# EAGLE board host (EAGLE 9.6.2)
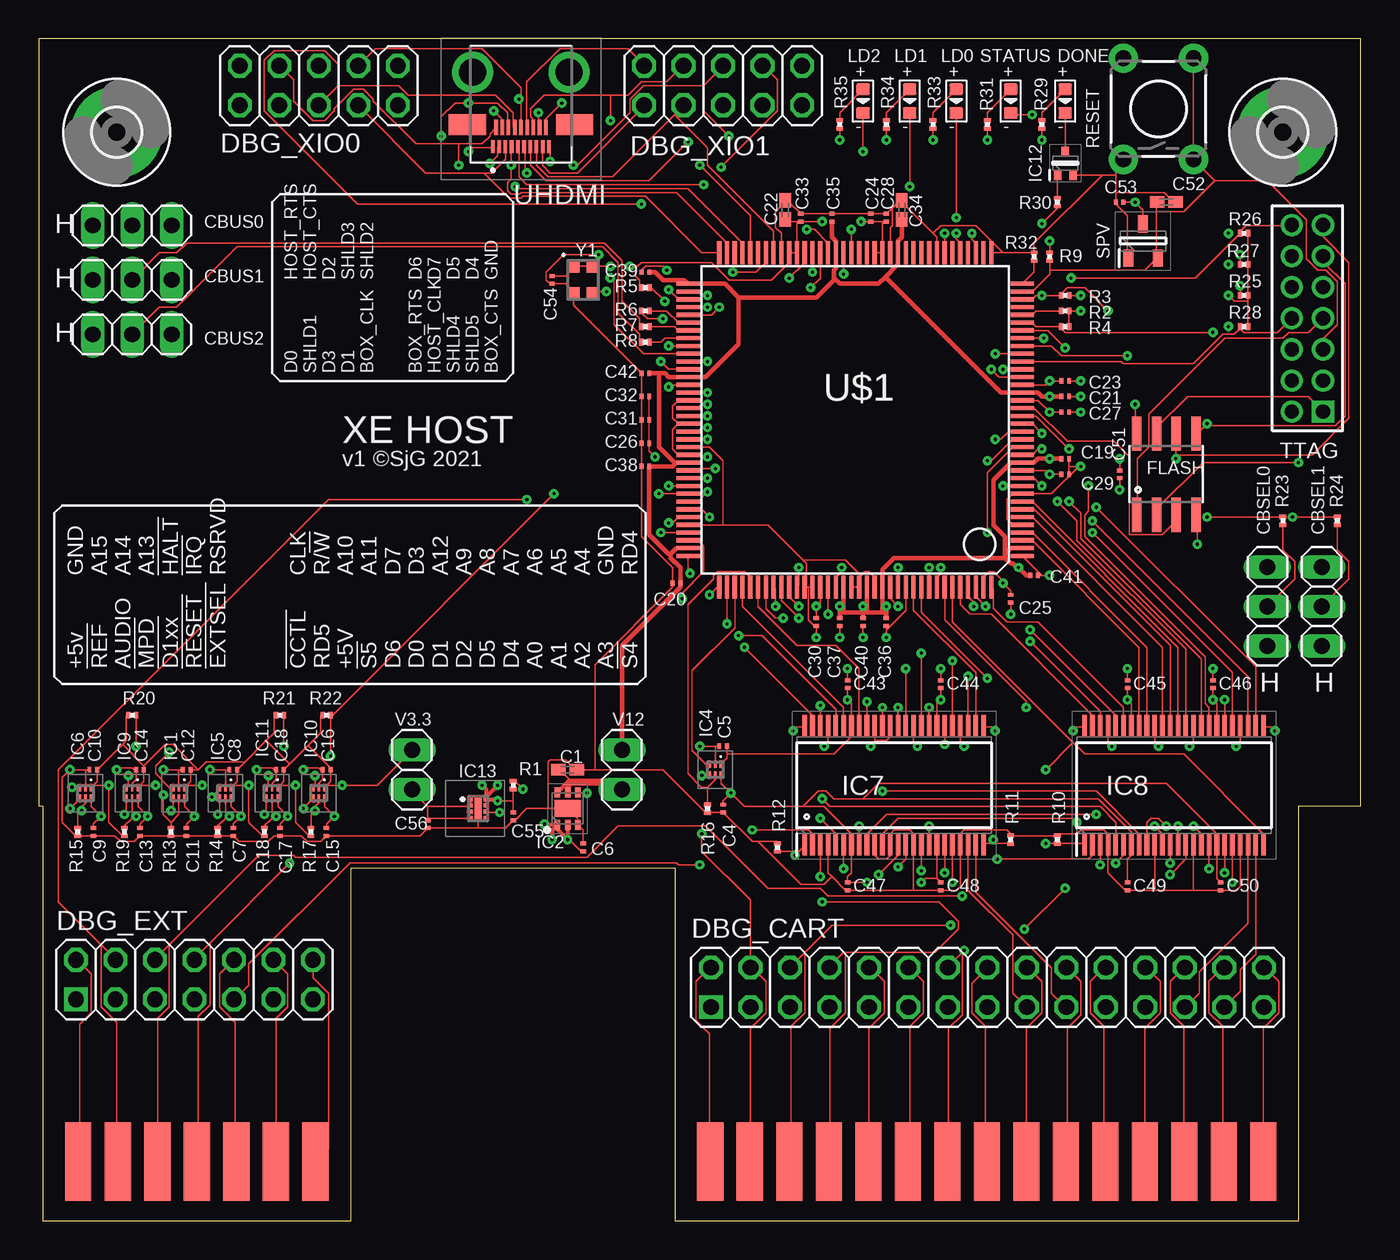
[diagram p5: board, top side]
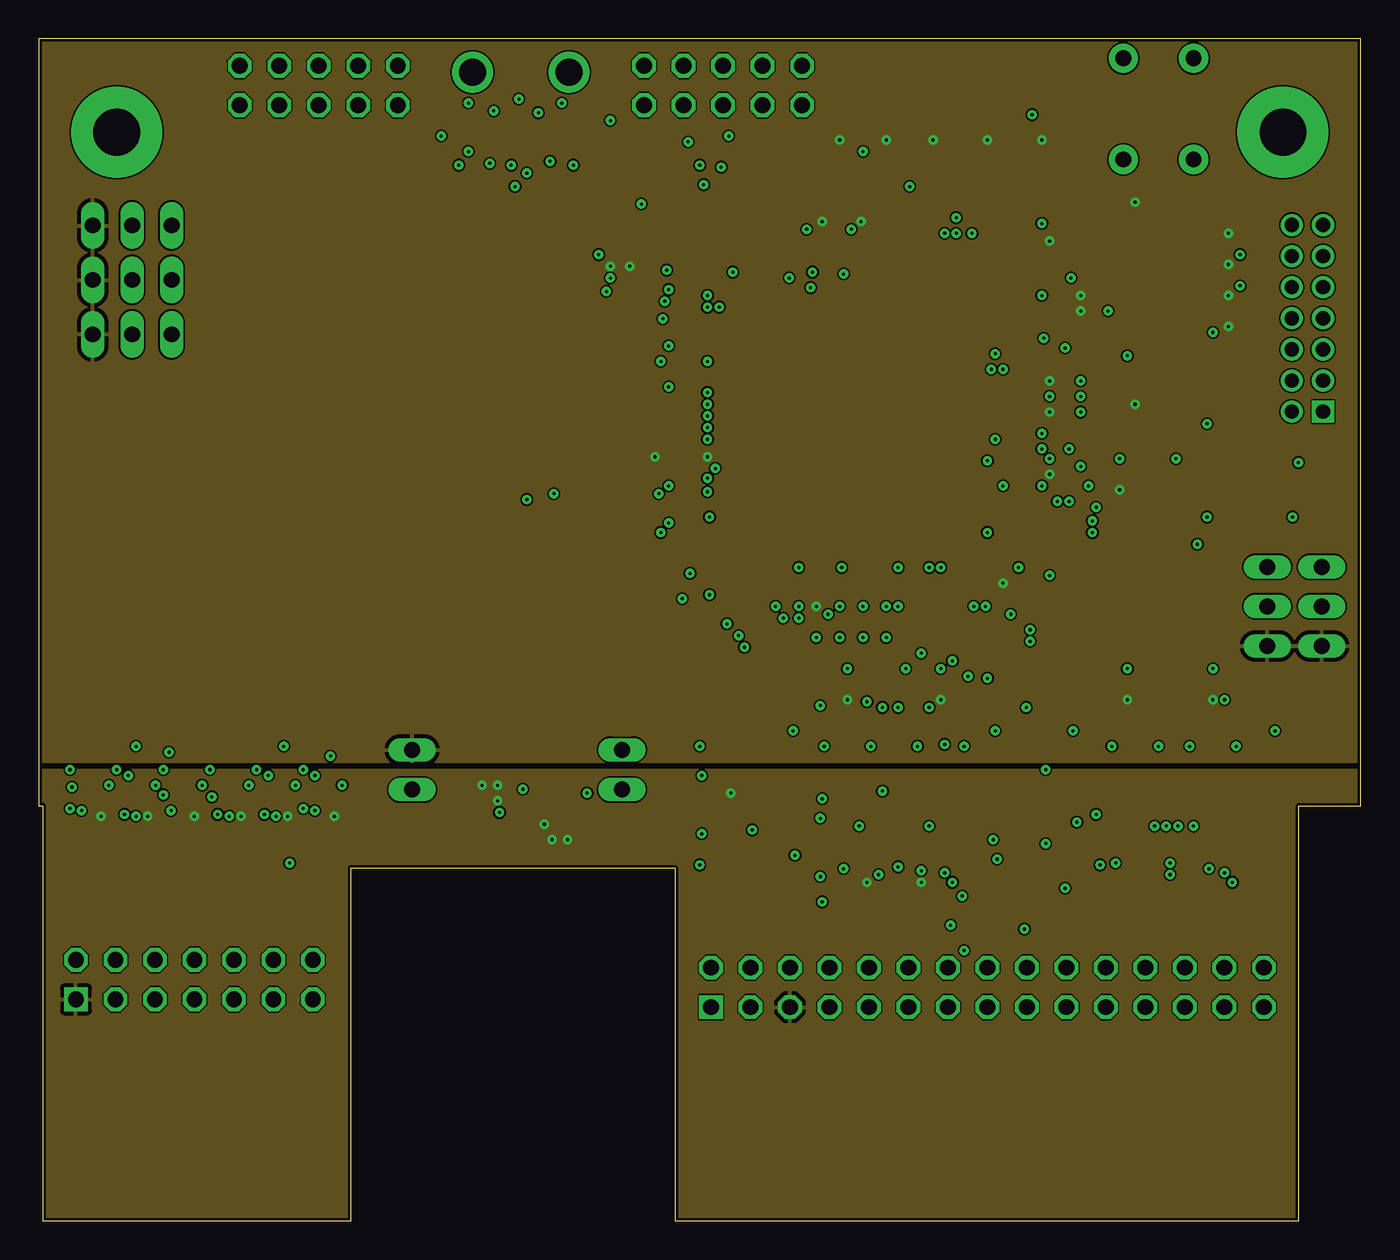
[diagram p6: board, inner layer Route2]
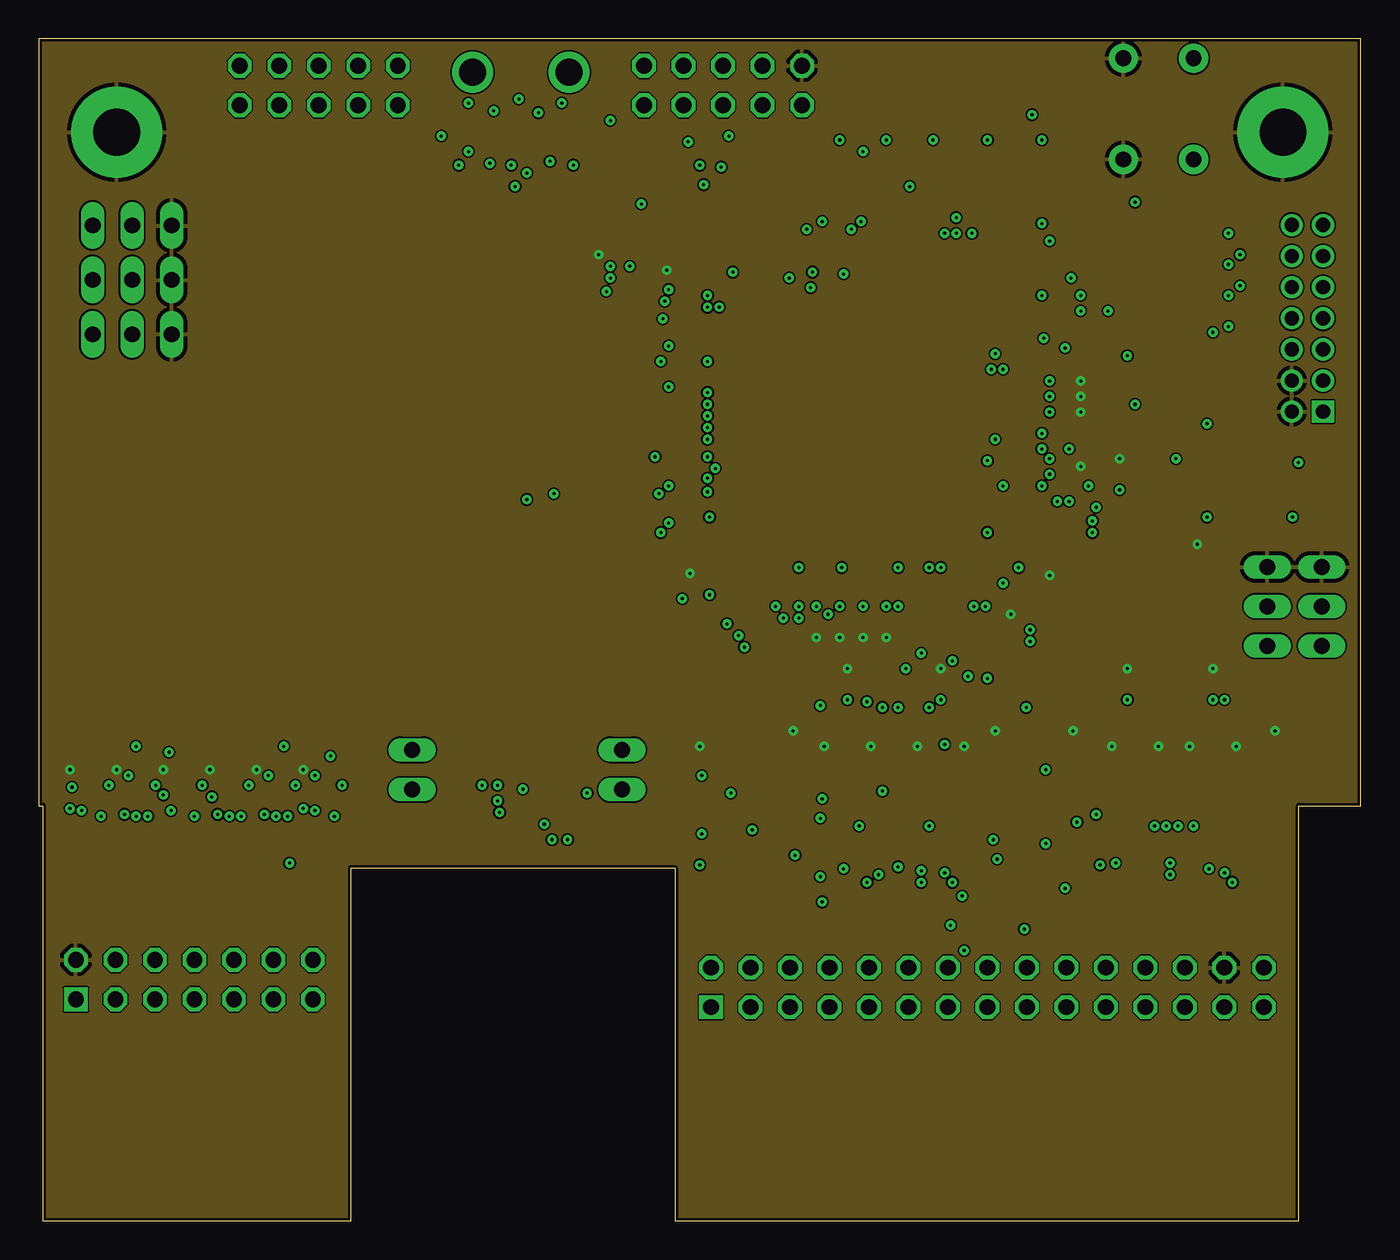
[diagram p7: board, inner layer Route15]
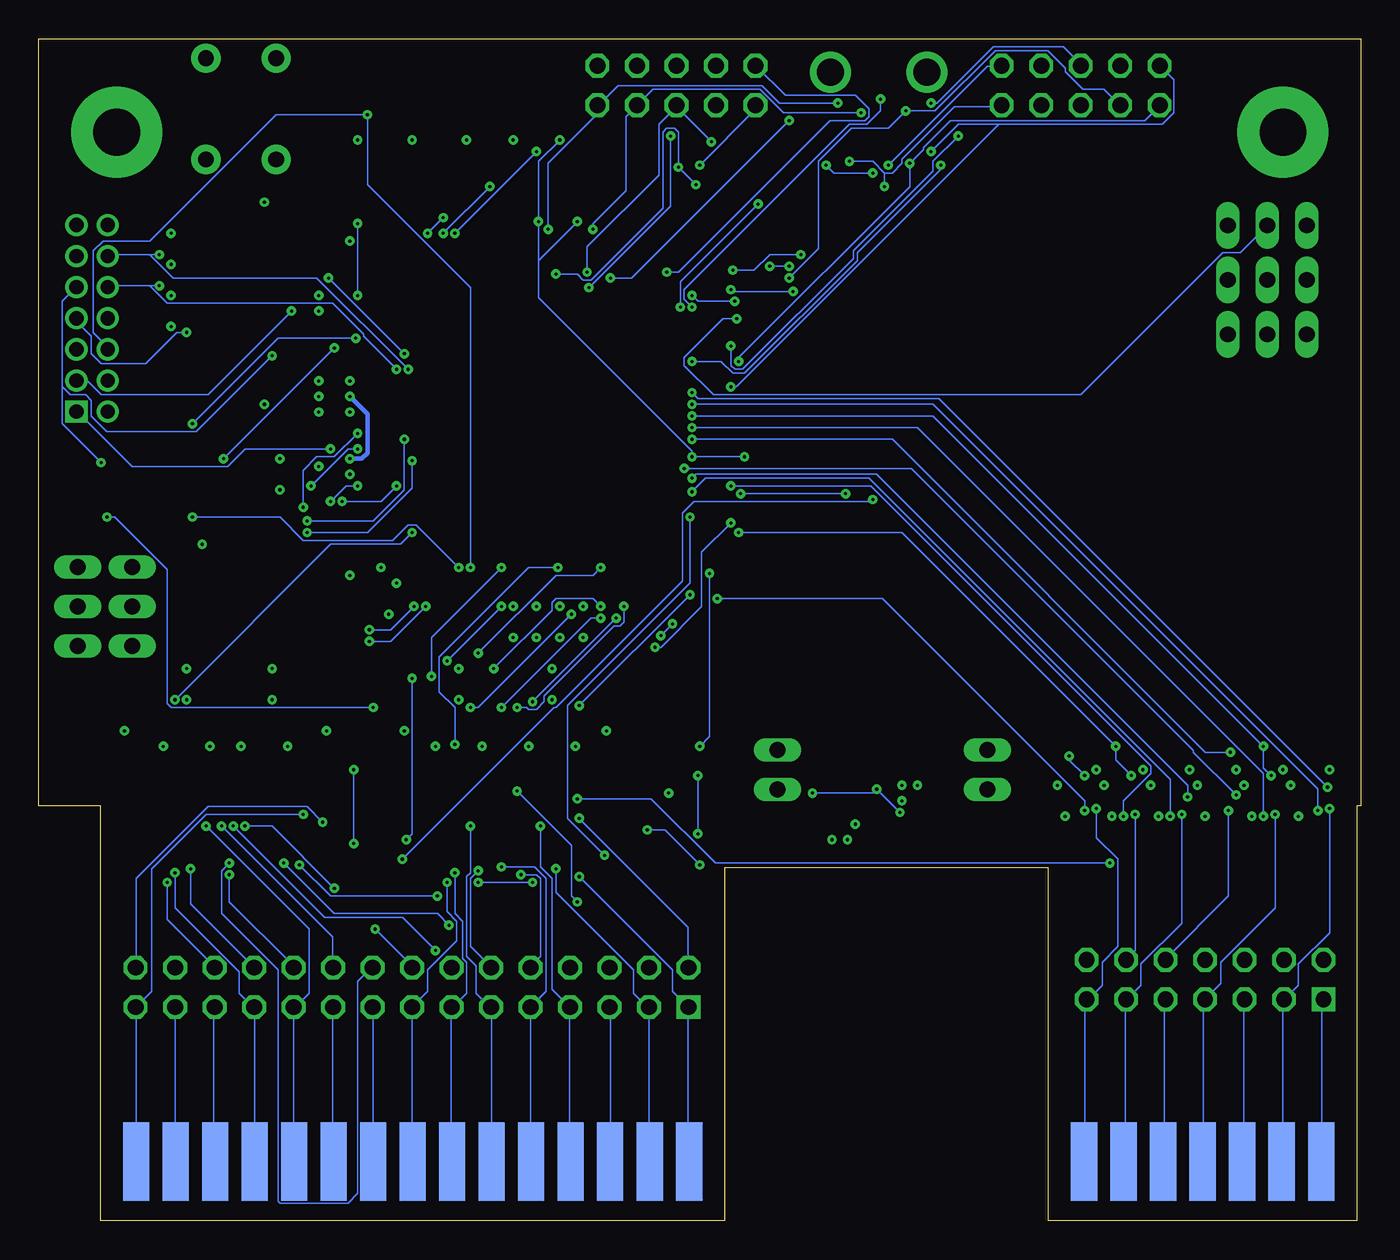
[diagram p8: board, bottom side, seen from below]

Size 85 x 76 mm. Coordinates in mm from the lower left corner, seen from the top.
Outline: 81.28,26.67 85,26.67 85,76 0,76 0,26.67
Copper layers (1+2*15+16): Top 0.035mm / dielectric 1.5mm / Route2 0.035mm / dielectric 0.15mm / Route15 0.035mm / dielectric 0.2mm / Bottom 0.035mm
Design rules "default *": minimum track width 4mil, minimum drill 0.2mm, track to track 4mil, track to pad 4mil, pad to pad 4mil, via to via 4mil, smd to smd 4mil, copper to edge 0.2mm, drill to drill 4mil, minimum pad ring 10mil, minimum via ring 8mil, stop-mask expansion 4mil, vias tented up to drill 0mil, thermal gap 10mil
Net classes: 1 +5v: width 0.305 mm; 2 +1.2v: width 0.305 mm
vRestrict: area -1,0 to 82,11; area 1,34.5 to 39,46; area 15,54 to 30.5,66

## Footprints (pad centres in the part's own frame; a part is rotated, then mirrored left to right if it is on the bottom)
C0402K = smd 0.925 x 0.74: 1 -0.6,0; 2 0.6,0
C0201 = smd 0.25 x 0.35: 1 -0.25,0; 2 0.25,0
1X03 = drill 1.016 long: 1 -2.54,0; 2 0,0; 3 2.54,0
2X15 = drill 1.016 square: 1 -17.78,-1.27 | drill 1.016 octagon: 2 -17.78,1.27; 3 -15.24,-1.27; 4 -15.24,1.27; 5 -12.7,-1.27; 6 -12.7,1.27; 7 -10.16,-1.27; 8 -10.16,1.27; 9 -7.62,-1.27; 10 -7.62,1.27; 11 -5.08,-1.27; 12 -5.08,1.27; 13 -2.54,-1.27; 14 -2.54,1.27; 15 0,-1.27; 16 0,1.27; 17 2.54,-1.27; 18 2.54,1.27; 19 5.08,-1.27; 20 5.08,1.27; 21 7.62,-1.27; 22 7.62,1.27; 23 10.16,-1.27; 24 10.16,1.27; 25 12.7,-1.27; 26 12.7,1.27; 27 15.24,-1.27; 28 15.24,1.27; 29 17.78,-1.27; 30 17.78,1.27
2X07 = drill 1.016 square: 1 -7.62,-1.27 | drill 1.016 octagon: 2 -7.62,1.27; 3 -5.08,-1.27; 4 -5.08,1.27; 5 -2.54,-1.27; 6 -2.54,1.27; 7 0,-1.27; 8 0,1.27; 9 2.54,-1.27; 10 2.54,1.27; 11 5.08,-1.27; 12 5.08,1.27; 13 7.62,-1.27; 14 7.62,1.27
2X05 = drill 1.016 octagon: 1 -5.08,-1.27; 2 -5.08,1.27; 3 -2.54,-1.27; 4 -2.54,1.27; 5 0,-1.27; 6 0,1.27; 7 2.54,-1.27; 8 2.54,1.27; 9 5.08,-1.27; 10 5.08,1.27
LED-0603 = smd 0.762 x 0.889: + -0.762,0; - 0.762,0
SO08 = smd 0.61 x 2.21: 1 -1.905,-2.616; 2 -0.635,-2.616; 3 0.635,-2.616; 4 1.905,-2.616; 5 1.905,2.616; 6 0.635,2.616; 7 -0.635,2.616; 8 -1.905,2.616
3,0-PAD = drill 3 pad 5.842: B3,0 0,0
74LVC1G3157GS132 = smd 0.15 x 0.5: 1 -0.35,-0.35; 2 0,-0.35; 3 0.35,-0.35; 4 0.35,0.35; 5 0,0.35; 6 -0.35,0.35
SON65P200X200X80-7N = smd 0.65 x 0.35: 1 -1.05,0.65; 2 -1.05,0; 3 -1.05,-0.65; 4 1.05,-0.65; 5 1.05,0; 6 1.05,0.65 | smd 1.1 x 1.7: 7 0,0
SOP50P810X120-48N = smd 1.425 x 0.3: 1 -3.812,5.75; 2 -3.812,5.25; 3 -3.812,4.75; 4 -3.812,4.25; 5 -3.812,3.75; 6 -3.812,3.25; 7 -3.812,2.75; 8 -3.812,2.25; 9 -3.812,1.75; 10 -3.812,1.25; 11 -3.812,0.75; 12 -3.812,0.25; 13 -3.812,-0.25; 14 -3.812,-0.75; 15 -3.812,-1.25; 16 -3.812,-1.75; 17 -3.812,-2.25; 18 -3.812,-2.75; 19 -3.812,-3.25; 20 -3.812,-3.75; 21 -3.812,-4.25; 22 -3.812,-4.75; 23 -3.812,-5.25; 24 -3.812,-5.75; 25 3.812,-5.75; 26 3.812,-5.25; 27 3.812,-4.75; 28 3.812,-4.25; 29 3.812,-3.75; 30 3.812,-3.25; 31 3.812,-2.75; 32 3.812,-2.25; 33 3.812,-1.75; 34 3.812,-1.25; 35 3.812,-0.75; 36 3.812,-0.25; 37 3.812,0.25; 38 3.812,0.75; 39 3.812,1.25; 40 3.812,1.75; 41 3.812,2.25; 42 3.812,2.75; 43 3.812,3.25; 44 3.812,3.75; 45 3.812,4.25; 46 3.812,4.75; 47 3.812,5.25; 48 3.812,5.75
SOTFL50P160X78-3N = smd 0.635 x 0.48: 1 -0.758,0.5; 2 -0.758,-0.5; 3 0.758,0
NCP186AMX330TAG = smd 0.26 x 0.35: 1 -0.6,-0.275; 2 -0.2,-0.275; 3 0.2,-0.275; 4 0.6,-0.275; 5 0.6,0.775; 6 0.2,0.775; 7 -0.2,0.775; 8 -0.6,0.775 | smd 1.44 x 0.44: 9 0,0.25
R0201 = smd 0.28 x 0.43: 1 -0.255,0; 2 0.255,0
TACTILE-PTH = drill 1.016 pad 1.88: 1 -3.251,2.261; 2 3.251,2.261; 3 -3.251,-2.261; 4 3.251,-2.261
SOT95P237X111-3N = smd 1.1 x 0.65: 1 -1.1,0.95; 2 -1.1,-0.95; 3 1.1,0
2X07M = drill 0.914 square: 1 -6,-1 | drill 0.914: 2 -6,1; 3 -4,-1; 4 -4,1; 5 -2,-1; 6 -2,1; 7 0,-1; 8 0,1; 9 2,-1; 10 2,1; 11 4,-1; 12 4,1; 13 6,-1; 14 6,1
TQFP144 = smd 0.27 x 1.5: 1 -8.75,-10.75; 2 -8.25,-10.75; 3 -7.75,-10.75; 4 -7.25,-10.75; 5 -6.75,-10.75; 6 -6.25,-10.75; 7 -5.75,-10.75; 8 -5.25,-10.75; 9 -4.75,-10.75; 10 -4.25,-10.75; 11 -3.75,-10.75; 12 -3.25,-10.75; 13 -2.75,-10.75; 14 -2.25,-10.75; 15 -1.75,-10.75; 16 -1.25,-10.75; 17 -0.75,-10.75; 18 -0.25,-10.75; 19 0.25,-10.75; 20 0.75,-10.75; 21 1.25,-10.75; 22 1.75,-10.75; 23 2.25,-10.75; 24 2.75,-10.75; 25 3.25,-10.75; 26 3.75,-10.75; 27 4.25,-10.75; 28 4.75,-10.75; 29 5.25,-10.75; 30 5.75,-10.75; 31 6.25,-10.75; 32 6.75,-10.75; 33 7.25,-10.75; 34 7.75,-10.75; 35 8.25,-10.75; 36 8.75,-10.75; 73 8.75,10.75; 74 8.25,10.75; 75 7.75,10.75; 76 7.25,10.75; 77 6.75,10.75; 78 6.25,10.75; 79 5.75,10.75; 80 5.25,10.75; 81 4.75,10.75; 82 4.25,10.75; 83 3.75,10.75; 84 3.25,10.75; 85 2.75,10.75; 86 2.25,10.75; 87 1.75,10.75; 88 1.25,10.75; 89 0.75,10.75; 90 0.25,10.75; 91 -0.25,10.75; 92 -0.75,10.75; 93 -1.25,10.75; 94 -1.75,10.75; 95 -2.25,10.75; 96 -2.75,10.75; 97 -3.25,10.75; 98 -3.75,10.75; 99 -4.25,10.75; 100 -4.75,10.75; 101 -5.25,10.75; 102 -5.75,10.75; 103 -6.25,10.75; 104 -6.75,10.75; 105 -7.25,10.75; 106 -7.75,10.75; 107 -8.25,10.75; 108 -8.75,10.75 | smd 1.5 x 0.27: 37 10.75,-8.75; 38 10.75,-8.25; 39 10.75,-7.75; 40 10.75,-7.25; 41 10.75,-6.75; 42 10.75,-6.25; 43 10.75,-5.75; 44 10.75,-5.25; 45 10.75,-4.75; 46 10.75,-4.25; 47 10.75,-3.75; 48 10.75,-3.25; 49 10.75,-2.75; 50 10.75,-2.25; 51 10.75,-1.75; 52 10.75,-1.25; 53 10.75,-0.75; 54 10.75,-0.25; 55 10.75,0.25; 56 10.75,0.75; 57 10.75,1.25; 58 10.75,1.75; 59 10.75,2.25; 60 10.75,2.75; 61 10.75,3.25; 62 10.75,3.75; 63 10.75,4.25; 64 10.75,4.75; 65 10.75,5.25; 66 10.75,5.75; 67 10.75,6.25; 68 10.75,6.75; 69 10.75,7.25; 70 10.75,7.75; 71 10.75,8.25; 72 10.75,8.75; 109 -10.75,8.75; 110 -10.75,8.25; 111 -10.75,7.75; 112 -10.75,7.25; 113 -10.75,6.75; 114 -10.75,6.25; 115 -10.75,5.75; 116 -10.75,5.25; 117 -10.75,4.75; 118 -10.75,4.25; 119 -10.75,3.75; 120 -10.75,3.25; 121 -10.75,2.75; 122 -10.75,2.25; 123 -10.75,1.75; 124 -10.75,1.25; 125 -10.75,0.75; 126 -10.75,0.25; 127 -10.75,-0.25; 128 -10.75,-0.75; 129 -10.75,-1.25; 130 -10.75,-1.75; 131 -10.75,-2.25; 132 -10.75,-2.75; 133 -10.75,-3.25; 134 -10.75,-3.75; 135 -10.75,-4.25; 136 -10.75,-4.75; 137 -10.75,-5.25; 138 -10.75,-5.75; 139 -10.75,-6.25; 140 -10.75,-6.75; 141 -10.75,-7.25; 142 -10.75,-7.75; 143 -10.75,-8.25; 144 -10.75,-8.75
XE_PBI = smd 1.684 x 5.052 bottom: 1 36.83,2.54; 2 34.29,2.54; 3 31.75,2.54; 4 29.21,2.54; 5 26.67,2.54; 6 24.13,2.54; 7 21.59,2.54; 8 19.05,2.54; 9 16.51,2.54; 10 13.97,2.54; 11 11.43,2.54; 12 8.89,2.54; 13 6.35,2.54; 14 3.81,2.54; 15 1.27,2.54; E1 -24.13,2.54; E2 -26.67,2.54; E3 -29.21,2.54; E4 -31.75,2.54; E5 -34.29,2.54; E6 -36.83,2.54; E7 -39.37,2.54 | smd 1.684 x 5.052: A 36.83,2.54; B 34.29,2.54; C 31.75,2.54; D 29.21,2.54; E 26.67,2.54; E:A -24.13,2.54; E:B -26.67,2.54; E:C -29.21,2.54; E:D -31.75,2.54; E:E -34.29,2.54; E:F -36.83,2.54; E:H -39.37,2.54; F 24.13,2.54; H 21.59,2.54; J 19.05,2.54; K 16.51,2.54; L 13.97,2.54; M 11.43,2.54; N 8.89,2.54; P 6.35,2.54; R 3.81,2.54; S 1.27,2.54
10118241001RLF = smd 0.23 x 0.85: 1 1.8,2.425; 3 1.4,2.425; 5 1,2.425; 7 0.6,2.425; 9 0.2,2.425; 11 -0.2,2.425; 13 -0.6,2.425; 15 -1,2.425; 17 -1.4,2.425; 19 -1.8,2.425 | smd 0.23 x 1: 2 1.6,1.2; 4 1.2,1.2; 6 0.8,1.2; 8 0.4,1.2; 10 0,1.2; 12 -0.4,1.2; 14 -0.8,1.2; 16 -1.2,1.2; 18 -1.6,1.2 | drill 1.75 pad 2.625: MH1 3.1,-2.35; MH2 -3.1,-2.35 | smd 2.4 x 1.38: MP1 3.45,1.02; MP2 -3.45,1.02
1X02 = drill 1.016 long: 1 -1.27,0; 2 1.27,0
DSC6001JE2B0240000 = smd 0.7 x 0.8: 1 -0.825,-0.625; 2 0.825,-0.625; 3 0.825,0.625; 4 -0.825,0.625

## Placement (x,y rotation side)
C1  10uF  [C0402K]  34,29 0 top
C4  100nF  [C0201]  44,26.5 270 top
C5  100nF  [C0201]  44,30.5 180 top
C6  1uF  [C0201]  35,24 90 top
C7  100nF  [C0201]  12.5,25 270 top
C8  100nF  [C0201]  12.5,29 180 top
C9  100nF  [C0201]  3.5,25 270 top
C10  100nF  [C0201]  3.5,29 180 top
C11  100nF  [C0201]  9.5,25 270 top
C12  100nF  [C0201]  9.5,29 180 top
C13  100nF  [C0201]  6.5,25 270 top
C14  100nF  [C0201]  6.5,29 180 top
C15  100nF  [C0201]  18.5,25 270 top
C16  100nF  [C0201]  18.5,29 180 top
C17  100nF  [C0201]  15.5,25 270 top
C18  100nF  [C0201]  15.5,29 180 top
C19  1uF  [C0201]  66,49 0 top
C20  10nF  [C0201]  41,41 180 top
C21  100nF  [C0201]  66,53 0 top
C22  10uF  [C0402K]  48,65 90 top
C23  1uF  [C0201]  66,54 0 top
C24  100nF  [C0201]  53.5,64.5 90 top
C25  10nF  [C0201]  62.5,40 270 top
C26  100nF  [C0201]  39,50 180 top
C27  1uF  [C0201]  66,52 0 top
C28  100nF  [C0201]  54.5,64.5 90 top
C29  10nF  [C0201]  66,48 0 top
C30  100nF  [C0201]  50,38.5 270 top
C31  1uF  [C0201]  39,51.5 180 top
C32  10nF  [C0201]  39,53 180 top
C33  100nF  [C0201]  49,64.5 90 top
C34  10uF  [C0402K]  55.5,65 90 top
C35  1uF  [C0201]  51,64.5 90 top
C36  100nF  [C0201]  54.5,38.5 270 top
C37  10nF  [C0201]  51.5,38.5 270 top
C38  100nF  [C0201]  39,48.5 180 top
C39  1uF  [C0201]  39,61 180 top
C40  100nF  [C0201]  53,38.5 270 top
C41  10nF  [C0201]  64,41.5 0 top
C42  100nF  [C0201]  39,54.5 180 top
C43  100nF  [C0201]  52,34.5 90 top
C44  100nF  [C0201]  58,34.5 90 top
C45  100nF  [C0201]  70,34.5 90 top
C46  100nF  [C0201]  75.5,34.5 90 top
C47  100nF  [C0201]  52,21.5 270 top
C48  100nF  [C0201]  58,21.5 270 top
C49  100nF  [C0201]  70,21.5 270 top
C50  100nF  [C0201]  76,21.5 270 top
C51  100nF  [C0201]  69.5,48 90 top
C52  10uF  [C0402K]  72.5,65.5 0 top
C53  100nF  [C0201]  69.5,65.5 180 top
C54  100nF  [C0201]  33,60.5 270 top
C55  1uF  [C0201]  30.5,26 270 top
C56  1uF  [C0201]  25,25.5 270 top
CBSEL0  [1X03]  79,39.5 90 top
CBSEL1  [1X03]  82.5,39.5 90 top
CBUS0  [1X03]  6,64 0 top
CBUS1  [1X03]  6,60.5 0 top
CBUS2  [1X03]  6,57 0 top
DBG_CART  [2X15]  61,15 0 top
DBG_EXT  [2X07]  10,15.5 0 top
DBG_XIO0  [2X05]  18,73 0 top
DBG_XIO1  [2X05]  44,73 0 top
DONE  GREEN-0603  [LED-0603]  66,72 270 top
FLASH  W25Q32JVSSIQ  [SO08]  72.5,48 0 top
H1  MOUNT-PAD-ROUND3.0  [3,0-PAD]  5,70 0 top
H2  MOUNT-PAD-ROUND3.0  [3,0-PAD]  80,70 0 top
IC1  74LVC1T45GS,132  [74LVC1G3157GS132]  9,27.5 180 top
IC2  NCP187AMT120TAG  [SON65P200X200X80-7N]  34,26.5 90 top
IC4  74LVC1T45GS,132  [74LVC1G3157GS132]  43.5,29 180 top
IC5  74LVC1T45GS,132  [74LVC1G3157GS132]  12,27.5 180 top
IC6  74LVC1T45GS,132  [74LVC1G3157GS132]  3,27.5 180 top
IC7  74ALVC164245DGG:11  [SOP50P810X120-48N]  55,28 90 top
IC8  74ALVC164245DGG:11  [SOP50P810X120-48N]  73,28 90 top
IC9  74LVC1T45GS,132  [74LVC1G3157GS132]  6,27.5 180 top
IC10  74LVC1T45GS,132  [74LVC1G3157GS132]  18,27.5 180 top
IC11  74LVC1T45GS,132  [74LVC1G3157GS132]  15,27.5 180 top
IC12  MUN2211T3G  [SOTFL50P160X78-3N]  66,68 90 top
IC13  NCP186BMX330TAG  [NCP186AMX330TAG]  28,26.5 270 top
LD0  GREEN-0603  [LED-0603]  59,72 270 top
LD1  GREEN-0603  [LED-0603]  56,72 270 top
LD2  GREEN-0603  [LED-0603]  53,72 270 top
R1  10K  [R0201]  30.5,28 270 top
R2  10K  [R0201]  66,58.5 180 top
R3  10K  [R0201]  66,59.5 180 top
R4  10K  [R0201]  66,57.5 180 top
R5  10K  [R0201]  39,60 0 top
R6  10K  [R0201]  39,58.5 0 top
R7  10K  [R0201]  39,57.5 0 top
R8  10K  [R0201]  39,56.5 0 top
R9  10K  [R0201]  65,62 270 top
R10  10K  [R0201]  65.5,24.5 270 top
R11  10K  [R0201]  62.5,24.5 270 top
R12  10K  [R0201]  47.5,24 270 top
R13  10K  [R0201]  8.5,25 90 top
R14  10K  [R0201]  11.5,25 90 top
R15  10K  [R0201]  2.5,25 90 top
R16  10K  [R0201]  43,26.5 90 top
R17  10K  [R0201]  17.5,25 270 top
R18  10K  [R0201]  14.5,25 270 top
R19  10K  [R0201]  5.5,25 270 top
R20  10K  [R0201]  6,32.5 180 top
R21  10K  [R0201]  15.5,32.5 180 top
R22  10K  [R0201]  18.5,32.5 180 top
R23  10K  [R0201]  80,45 90 top
R24  10K  [R0201]  83.5,45 90 top
R25  10K  [R0201]  77.5,59.5 180 top
R26  10K  [R0201]  77.5,63.5 180 top
R27  10K  [R0201]  77.5,61.5 180 top
R28  10K  [R0201]  77.5,57.5 180 top
R29  220R  [R0201]  64.5,70.5 90 top
R30  100K  [R0201]  65.5,65.5 90 top
R31  220R  [R0201]  61,70.5 90 top
R32  12K  [R0201]  64,62 270 top
R33  220R  [R0201]  57.5,70.5 90 top
R34  220R  [R0201]  54.5,70.5 90 top
R35  220R  [R0201]  51.5,70.5 90 top
RESET  [TACTILE-PTH]  72,71.5 90 top
SPV  MIC803-30D2VC3-TR  [SOT95P237X111-3N]  71,63 90 top
STATUS  GREEN-0603  [LED-0603]  62.5,72 270 top
TTAG  [2X07M]  81.58,58.03 90 top
U$1  T8  [TQFP144]  52.5,51.5 90 top
U$2  XE_PBI  [XE_PBI]  41.91,1.27 0 top
UHDMI  10118241-001RLF  [10118241001RLF]  31,71.5 180 top
V3.3  [1X02]  24,29 270 top
V12  [1X02]  37.5,29 270 top
Y1  DSC6001J  [DSC6001JE2B0240000]  35,60.5 270 top

## Tracks (layer width: path | path; a pad name or v marks a point on that pad's centre or on a via)
!A8_CCTL!  (via drill 0.2)
  Top 0.102: v50.25,22.12 IC7.3
  Bottom 0.102: v50.25,22.12 44.25,16.12 44.25,14.75 43.25,13.75 DBG_CART.1 43.25,13.62 43.25,3.88 U$2.15
!A8_CLK!  (via drill 0.2)
  Top 0.102: IC7.5 51.25,24.88 v50.25,25.88 | U$2.S 43.12,3.88 43.12,12 42.25,12.88 42.25,15.38 43.12,16.25 DBG_CART.2
  Bottom 0.102: v50.25,25.88 43.25,18.88 43.25,16.38 DBG_CART.2
!A8_D1XX!  (via drill 0.2)
  Top 0.102: IC7.2 49.75,24.88 49.5,25.12 v45.88,25.12 | v42.5,22.88 41.12,22.88 41,23 20,23 13.5,16.5 13.5,15.12 12.62,14.25 DBG_EXT.9
  Bottom 0.102: v45.88,25.12 44.75,25.12 v42.5,22.88 | U$2.E3 12.62,3.88 12.62,14.12 DBG_EXT.9
!A8_EXTSEL!  (via drill 0.2)
  Top 0.102: v17,26.5 IC10.4
  Bottom 0.102: v17,26.5 17,24.62 15.62,23.25 15.62,17.62 16.62,16.62 16.62,15.12 17.5,14.25 DBG_EXT.13 17.62,14.12 17.75,14 17.75,3.88 U$2.E1
!A8_HALT!  (via drill 0.2)
  Top 0.102: v8.5,26.38 8.62,26.5 8.62,27.12 IC1.4 | U$2.E:C 12.62,3.88 12.62,12.75 11.62,13.75 11.62,15.88 12.5,16.75 DBG_EXT.10
  Bottom 0.102: v8.5,26.38 8.5,20.88 12.5,16.88 DBG_EXT.10
!A8_IRQ!  (via drill 0.2)
  Top 0.102: v14.5,26.12 14.62,26.25 14.62,27.12 IC11.4 | U$2.E:B 15.25,3.88 15.25,13 16,13.75 16,15.88 15.12,16.75 DBG_EXT.12
  Bottom 0.102: v14.5,26.12 14.5,17.38 15,16.88 DBG_EXT.12
!A8_MPD!  (via drill 0.2)
  Top 0.102: v5.5,26.12 5.62,26.25 5.62,27.12 IC9.4
  Bottom 0.102: v5.5,26.12 5.5,20.12 9,16.62 9,15.25 10,14.25 DBG_EXT.7 10,14.12 10.12,14 10.12,3.88 U$2.E4
!A8_REF!  (via drill 0.2)
  Top 0.102: v2,26.5 IC6.4
  Bottom 0.102: v2,26.5 2,18.5 4,16.5 4,15.12 4.88,14.25 DBG_EXT.3 5,14.12 5,3.88 U$2.E6
!A8_RESET!  (via drill 0.2)
  Top 0.102: v11.5,26.12 11.62,26.25 11.62,27.12 IC5.4
  Bottom 0.102: v11.5,26.12 11.5,19.12 14.12,16.5 14.12,15.12 15,14.25 DBG_EXT.11 15.12,14.12 15.12,3.88 U$2.E2
!A8_S4!  (via drill 0.2)
  Top 0.102: IC7.9 53.25,24.88 54.5,26.12 v68,26.12
  Bottom 0.102: v68,26.12 74.25,26.12 77.75,22.62 77.75,14.75 78.75,13.75 DBG_CART.29 78.75,13.62 78.75,3.88 U$2.1
!A8_S5!  (via drill 0.2)
  Top 0.102: v52.75,25.38 IC7.8
  Bottom 0.102: v52.75,25.38 52.75,22.75 52,22 52,14.88 50.88,13.75 DBG_CART.7 50.88,13.62 50.88,3.88 U$2.12
!CCTL!  (via drill 0.2)
  Top 0.102: v50.25,33.12 IC7.46 | v43.12,40.25 43.62,40.75 U$1.109
  Bottom 0.102: v43.12,40.25 v50.25,33.12
!CRESET!
  Top 0.102: 65,61.12 65,60.88 63.88,59.75 U$1.35 | 65,61.12 R9.2 | 71.88,64.88 71.88,62 SPV.2 71.88,61.88 71.12,61.12 65,61.12 | 71.88,64.88 71.88,65.5 C52.1 | 75.62,66.88 79,66.88 81.5,64.38 81.5,61.88 82.25,61.12 82.75,61.12 83.5,60.38 83.5,57.62 82.62,56.75 82.62,56.12 TTAG.5 | 75.62,66.88 74.38,68.12 RESET.3 RESET.4 | 71.88,64.88 73.62,64.88 75.62,66.88
!D1XX!  (via drill 0.2)
  Top 0.102: IC7.47 49.75,32.5 v45.38,36.88 | v40.5,44.88 40.75,44.88 41.12,45.25 U$1.103
  Bottom 0.102: v45.38,36.88 45,36.88 42.38,39.5 42.38,43 v40.5,44.88
!EXTSEL!  (via drill 0.2)
  Top 0.102: v18.75,29.88 R22.1 18.88,32.5 v33.12,46.75 | v17.75,28.62 17.75,28 17.62,27.88 IC10.3 | v39.88,46.75 U$1.100
  Bottom 0.102: v18.75,29.88 18.75,29.62 v17.75,28.62 | v33.12,46.75 v39.88,46.75
!HALT!  (via drill 0.2)
  Top 0.102: v8.38,30.12 7.5,29.25 7.5,28.75 8.38,27.88 8.62,27.88 IC1.3 | U$1.93 v43,50.25
  Bottom 0.102: v8.38,30.12 10,30.12 30.12,50.25 v43,50.25
!IRQ!  (via drill 0.2)
  Top 0.102: v15.75,30.5 R21.1 | v14.75,28.62 14.75,28 14.62,27.88 IC11.3 | v40,44.25 U$1.105
  Bottom 0.102: v14.75,28.62 15.75,29.62 v15.75,30.5 29.5,44.25 v40,44.25
!MPD!  (via drill 0.2)
  Top 0.102: v6.25,30.5 R20.1 | v5.75,28.62 5.75,28 5.62,27.88 IC9.3 | v43,51.75 U$1.90
  Bottom 0.102: v5.75,28.62 6.25,29.12 v6.25,30.5 27.5,51.75 v43,51.75
!REF!  (via drill 0.2)
  Top 0.102: v2.12,27.88 2.62,27.88 IC6.3 | U$1.87 v43,53.25
  Bottom 0.102: v2.12,27.88 27.12,52.88 42.62,52.88 v43,53.25
!RESET!  (via drill 0.2)
  Top 0.102: v11.12,27.25 11.62,27.75 IC5.3 | U$1.98 v43,47.75
  Bottom 0.102: v11.12,27.25 11.12,28 31.12,48 42.75,48 v43,47.75
!S4!  (via drill 0.2)
  Top 0.102: v53.25,33.38 IC7.40 | v47.88,38.75 47.38,38.75 46.75,39.38 U$1.115
  Bottom 0.102: v47.88,38.75 v53.25,33.38
!S5!
  Top 0.102: IC7.41 52.75,35.5 51.25,37 48.75,37 46.25,39.5 U$1.114
!STATUS!  (via drill 0.2)
  Top 0.102: v63.88,71.12 62.5,71.12 STATUS.- | v57.25,42 U$1.136
  Bottom 0.102: TTAG.6 80.5,56.12 81.5,57.12 81.5,62.38 80.88,63 77.88,63 69.75,71.12 v63.88,71.12 63.88,66.62 57.25,60 v57.25,42
!TEST!  (via drill 0.2)
  Top 0.102: v40.25,59.12 39.38,60 R5.2 | v43,59.5 42.62,59.5 42.38,59.75 U$1.74
  Bottom 0.102: v40.25,59.12 42.62,59.12 v43,59.5
+1.2V  (via drill 0.2)
  Top 0.305: C19.1 v65,49 64.25,49 64,48.75 U$1.13 62.5,48.75 61.38,47.62 61.38,44.75 62.12,44 62.12,42.88 | C21.1 v65,53 64.5,53 64.25,53.25 U$1.22 61.88,53.25 54.44,60.69 | C41.1 63.5,41.5 v63,42 62.88,42 62.62,42.25 62.5,42.25 62.12,42.62 | 62.12,42.88 62.12,42.62 | 62.12,42.88 62.5,43.25 U$1.2 | v54.5,39.5 54.5,39.12 | 54.5,39.12 C36.1 | v51.5,39.5 51.5,39.12 | 51.5,39.12 C37.1 | v53,39.5 53,39.12 | 53,39.12 C40.1 | 53,39.12 51.75,39.12 | 51.75,39.12 51.5,39.12 | 53.25,39.12 54.25,39.12 | 54.25,39.12 54.5,39.12 | 53.25,39.12 53,39.12 | 51.75,39.12 U$1.125 | 53.25,39.12 U$1.128 | 54.25,39.12 U$1.130 54.25,41.88 55,42.62 62.12,42.62 | C39.1 39.62,61 40.12,60.5 41.5,60.5 U$1.73 44.12,60.25 45,59.38 | C35.1 51,63.25 51.25,63 U$1.57 51.25,61.25 51.12,61.12 51.12,60.62 | C34.1 55.5,63.25 55.25,63 U$1.49 55.25,61.5 54.44,60.69 | 51.12,60.62 51.5,60.25 54,60.25 54.44,60.69 | 45,59.38 50,59.38 51.12,60.5 51.12,60.62 | 39.88,54.5 40.25,54.5 40.5,54.25 U$1.85 42.88,54.25 45,56.38 45,59.38 | 39.88,54.5 C42.1 | 40.62,42.88 40.62,42.62 41.25,42 C20.1 41.25,40.75 37.5,37 V12.1 | 40.62,42.88 41,43.25 U$1.107 | 40.94,48.69 41,48.75 U$1.96 | 40.94,48.69 40.75,48.5 C38.1 39.25,44.12 40.5,42.88 40.62,42.88 | 39.88,54.5 39.88,49.75 40.94,48.69
  Bottom 0.305: v65,49 64.25,49 63.88,49.38 63.88,51.88 v65,53
+3V3  (via drill 0.2)
  Top 0.102: IC10.1 18.5,28 | 18.5,28 18.75,28.25 C16.1 18.75,29.12 17.38,30.5 17.25,30.5 | 18.5,28 v19.5,28 21.75,28 24,30.25 V3.3.1 | IC11.1 15.5,28 | 15.5,28 15.75,28.25 C18.1 16.12,29.38 | 15.5,28 v16.5,28 16.5,25.62 17.38,24.75 R17.2 | 16.12,29.38 17.25,30.5 | 17.25,30.5 18.12,31.38 18.12,32.5 R22.2 | IC9.1 6.5,28 | 6.5,28 6.75,28.25 C14.1 6.75,29.25 | 6.5,28 v7.5,28 | IC6.1 3.5,28 | 3.5,28 3.75,28.25 C10.1 5.38,30.62 | 3.5,28 v4.5,28 4.5,25.62 5.38,24.75 R19.2 | 5.38,30.62 5.62,30.88 5.62,32.5 R20.2 | 5.38,30.62 6.75,29.25 | IC1.1 9.5,28 | 9.5,28 9.75,28.25 C12.1 10.25,29 | 9.5,28 v10.5,28 | IC5.1 12.5,28 | 12.5,28 12.75,28.25 C8.1 13.25,29.5 | 12.5,28 v13.5,28 13.5,25.62 14.38,24.75 R18.2 | 13.25,29.5 14.62,30.88 | 14.62,30.88 15.12,31.38 15.12,32.5 R21.2 | 10.25,29 10.75,29.5 13.25,29.5 | 6.75,29.25 8.12,30.62 8.62,30.62 10.25,29 | 14.62,30.88 16.12,29.38 | 48.75,64.25 48.12,64.25 48,64.38 C22.1 | 48.75,64.25 C33.1 v50.38,64.25 | 48.75,64.25 U$1.62 U$1.63 48.25,61.62 47.12,60.5 44.38,60.5 43.25,61.62 38.75,61.62 38.5,61.38 | C54.1 33.88,60.75 34.38,61.25 Y1.1 34.38,61.38 35.62,61.38 | 38.5,61.38 38.38,61.25 38.38,60.75 38.62,60.5 38.62,60 R5.1 | v36.75,61.38 35.62,61.38 | 38.5,61.38 v38,61.38 | 35.62,61.38 Y1.4 | 44.25,30 44.25,29.75 IC4.1 | 44.25,30 C5.1 | 44.25,30 51.12,30 52.25,31.12 IC7.42 52.25,33.25 v52,33.5 C43.1 | 41.12,51.25 40.75,51.62 40.75,52.38 41.12,52.75 U$1.88 | C32.1 C31.1 C26.1 39.25,49.5 v39.62,49.12 | v43,49.12 41.88,49.12 U$1.95 41.12,49.25 40.75,49.62 40.75,50.88 41.12,51.25 | 41.12,51.25 U$1.91 | R25.1 77.75,59.12 | 77.75,59.12 R28.1 | R27.1 R26.1 | R27.1 R25.1 | R25.1 | R27.1 | C28.1 54.25,64.25 | 54.25,64.25 C24.1 v52.88,64.25
  Top 0.102: 54.25,64.25 U$1.51 U$1.52 | R4.1 R2.1 v67,58.5 | C44.1 v58,33.5 57.75,33.25 IC7.31 | C30.1 v50,39.5 50.25,39.75 U$1.122 | C25.1 62.5,40.5 v62,41 62,41.12 61.38,41.75 61.12,41.75 60.75,41.38 U$1.143 | C45.1 v70,33.5 70.25,33.25 IC8.42 | C46.1 v75.5,33.5 75.75,33.25 IC8.31 | C29.1 v65,48 64.75,48.25 U$1.12 | v69.5,47 C51.1 | C27.1 v65,52 64.25,52.75 U$1.21 | C23.1 v65,54 64.75,53.75 U$1.23 | C53.1 v70.5,65.5 71,65 SPV.3 | v65,63 R9.1 | v51.5,69.5 R35.1 | v54.5,69.5 R34.1 | v57.5,69.5 R33.1 | v61,69.5 R31.1 | v64.5,69.5 R29.1 | v67,59.5 R3.1 | v70.5,52.5 70.5,50.62 FLASH.8 | 77.75,59.12 76.88,59.12 v76.5,59.5
  Bottom 0.102: v38,61.38 v36.75,61.38 | v39.62,49.12 v43,49.12 43,49.5 52.88,59.38 52.88,61.75 | v51.5,69.5 52.88,68.12 v52.88,64.25 52.88,61.75 | 52.88,61.75 v50.38,64.25
  other vias: 76.5,63.5 76.5,61.5 76.5,57.5
  pour Route2: -0.5,77.5 85,77.5 85,29.5 -0.5,29.5
+5V  (via drill 0.2)
  Top 0.102: C50.1 75.75,22 IC8.18 75.75,24.88 72.5,28.12 54,28.12 53,27.12 | C49.1 70,23.25 70.25,23.5 IC8.7 70.25,25 68.12,27.12 53,27.12 | 57.75,22 C48.1 | IC7.18 57.75,22 | R1.2 30.5,27 | 30.5,27 C55.1 | C9.1 3.5,25.5 v4,26 3.38,26.62 3.38,27.12 IC6.6 | C13.1 6.5,25.5 v7,26 6.38,26.62 6.38,27.12 IC9.6 | C11.1 9.5,25.5 v10,26 9.38,26.62 9.38,27.12 IC1.6 | C7.1 12.5,25.5 v13,26 12.38,26.62 12.38,27.12 IC5.6 | C17.1 15.5,25.5 v16,26 15.38,26.62 15.38,27.12 IC11.6 | C15.1 18.5,25.5 v19,26 18.38,26.62 18.38,27.12 IC10.6 | C6.1 34.88,23.75 34.12,24.5 v34,24.5 | IC13.7 28.75,26.75 28.75,27 IC13.8 | C4.1 44,27 v44.5,27.5 | v44.5,27.5 43.88,28.12 43.88,28.62 IC4.6 | v29.5,27 30.5,27 | 49.12,26.62 45.38,26.62 v44.5,27.5 | 49.12,26.62 50.5,26.62 52.25,24.88 IC7.7 52.25,22.38 52,22.12 C47.1 v53.25,21.75 | 57.75,22 57,22 v56.75,21.75 | 53,27.12 51.12,27.12 50.62,27.62 50.12,27.62 49.12,26.62
  Top 0.254: IC13.8 28.77,27.73 v28.5,28 | IC13.8 28.77,27.27 v29.5,28 | IC13.8 29.4,27.1 v29.5,27 | IC2.1 32.55,25.45 v32.5,25.5 | IC2.1 33,25.1 v33,24.5 | IC2.1 33.35,25.15 v34,24.5 IC2.2
  Bottom 0.102: v53.25,21.75 v56.75,21.75 | U$2.E7 2.5,3.88 2.5,14.12 DBG_EXT.1 | U$2.13 48.25,3.88 48.25,13.62 DBG_CART.5
  pour Route2: -0.5,29 85.5,29 85.5,0 -0.5,0
A0  (via drill 0.2)
  Top 0.102: IC8.33 74.75,36.12 67,43.88 67,45.5 v66.25,46.25 | v64.5,47.25 64,47.75 U$1.11
  Bottom 0.102: v66.25,46.25 65.25,47.25 v64.5,47.25
A1  (via drill 0.2)
  Top 0.102: v76.25,33.5 IC8.30 | v61,44.25 61,48.12 62.62,49.75 U$1.15
  Bottom 0.102: v76.25,33.5 66.25,43.5 61.75,43.5 v61,44.25
A2  (via drill 0.2)
  Top 0.102: IC8.27 77.75,35 v67.75,45 | v61.5,50.25 61.88,50.25 62.38,50.75 U$1.17
  Bottom 0.102: v67.75,45 63.5,45 61.5,47 v61.5,50.25
A3  (via drill 0.2)
  Top 0.102: IC8.26 78.25,35.62 v68,45.88 | v64.5,50.62 63.88,51.25 U$1.18
  Bottom 0.102: v68,45.88 68,48.25 67.12,49.12 66,49.12 v64.5,50.62
A4  (via drill 0.2)
  Top 0.102: IC8.29 76.75,35.25 v67.75,44.25 | v61,48.88 61.25,48.88 62.62,50.25 U$1.16
  Bottom 0.102: v67.75,44.25 63.88,44.25 61,47.12 v61,48.88
A5  (via drill 0.2)
  Top 0.102: IC8.32 75.25,33 75,33.25 75,36.25 67.25,44 67.25,45.38 67.5,45.62 v67.5,47.25 | v64.5,49.62 64.25,49.62 63.88,49.25 U$1.14
  Bottom 0.102: v67.5,47.25 65.12,49.62 v64.5,49.62
A6  (via drill 0.2)
  Top 0.102: IC8.35 73.75,36.75 66.75,43.75 66.75,45 v65.5,46.25 | U$1.10 v62,47.25
  Bottom 0.102: v65.5,46.25 63,46.25 v62,47.25
A7
  Top 0.102: IC8.36 73.25,36.88 63.88,46.25 U$1.8
A8
  Top 0.102: IC8.37 72.75,37 64,45.75 U$1.7
A8_A0  (via drill 0.2)
  Top 0.102: IC8.16 74.75,24.88 v74.25,25.38
  Bottom 0.102: v74.25,25.38 67.62,18.75 67.62,14.62 68.5,13.75 DBG_CART.21 68.62,13.62 68.62,3.88 U$2.5
A8_A1  (via drill 0.2)
  Top 0.102: v76.25,22.38 IC8.19
  Bottom 0.102: v76.25,22.38 76.25,20.12 72.12,16 72.12,14.62 71.25,13.75 DBG_CART.23 71.12,13.62 71.12,3.88 U$2.4
A8_A2
  Top 0.102: IC8.22 77.75,19.12 74.62,16 74.62,14.62 73.75,13.75 DBG_CART.25
  Bottom 0.102: U$2.3 73.75,3.88 73.75,13.62 DBG_CART.25
A8_A3
  Top 0.102: IC8.23 78.25,17.12 77.25,16.12 77.25,14.75 76.25,13.75 DBG_CART.27
  Bottom 0.102: U$2.2 76.25,3.88 76.25,13.62 DBG_CART.27
A8_A4  (via drill 0.2)
  Top 0.102: v76.75,21.75 IC8.20 | U$2.C 73.62,3.88 73.62,12.5 72.75,13.38 72.75,15.38 73.62,16.25 DBG_CART.26
  Bottom 0.102: v76.75,21.75 76.75,19.38 73.75,16.38 DBG_CART.26
A8_A5  (via drill 0.2)
  Top 0.102: v75.25,22.62 IC8.17 | U$2.D 71.12,3.88 71.12,12.38 72.12,13.38 72.12,15.38 71.25,16.25 DBG_CART.24
  Bottom 0.102: v75.25,22.62 75.25,20.38 71.25,16.38 DBG_CART.24
A8_A6  (via drill 0.2)
  Top 0.102: IC8.14 73.75,23.25 v72.75,22.25 | U$2.E 68.5,3.88 68.5,12.5 67.62,13.38 67.62,15.38 68.5,16.25 DBG_CART.22
  Bottom 0.102: v72.75,22.25 72.75,20.5 68.62,16.38 DBG_CART.22
A8_A7  (via drill 0.2)
  Top 0.102: v73.25,25.38 IC8.13 | U$2.F 66.12,3.88 66.12,12.38 67,13.25 67,15.38 66.12,16.25 DBG_CART.20
  Bottom 0.102: v73.25,25.38 66.12,18.25 66.12,16.38 DBG_CART.20
A8_A8  (via drill 0.2)
  Top 0.102: v72.75,23 IC8.12 | U$2.H 63.5,12.38 64.5,13.38 64.5,15.38 63.62,16.25 DBG_CART.18
  Bottom 0.102: v72.75,23 73.25,22.5 73.25,19.75 69.62,16.12 69.62,1.25 69.5,1.12 65.12,1.12 64.5,1.75 64.5,15.38 63.62,16.25 DBG_CART.18
A8_A9  (via drill 0.2)
  Top 0.102: IC8.11 72.25,24.88 v71.75,25.38 | v63.38,18.75 v66,21.38 | U$2.J 60.88,3.88 60.88,12.5 60,13.38 60,15.25 61,16.25 DBG_CART.16
  Bottom 0.102: v71.75,25.38 70,25.38 v66,21.38 | v63.38,18.75 61,16.38 DBG_CART.16
A8_A10  (via drill 0.2)
  Top 0.102: IC8.6 69.75,23.5 v69.25,23 | v58.62,19 51,19 49.25,17.25 | 49.25,17.25 48.38,16.38 DBG_CART.6 | 49.25,17.25 49.25,13.38 48.38,12.5 48.38,3.88 U$2.P
  Bottom 0.102: v69.25,23 66,19.75 59.38,19.75 v58.62,19
A8_A11  (via drill 0.2)
  Top 0.102: IC8.8 70.75,24.88 68,27.62 v54.25,27.62 | v50.38,20.5 57.88,20.5 59.12,19.25 59.12,18.75 57.62,17.25 51.88,17.25 | 51.88,17.25 51.75,17.25 50.88,16.38 DBG_CART.8 | 51.88,17.25 51.88,13.38 50.88,12.38 50.88,3.88 U$2.N
  Bottom 0.102: v54.25,27.62 50.75,24.12 50.75,20.88 v50.38,20.5
A8_A12  (via drill 0.2)
  Top 0.102: IC8.9 71.25,25.62 71.5,25.88 72,25.88 v72.5,25.38 | 59.38,17.25 58.5,16.38 DBG_CART.14 | 59.38,17.25 59.38,13.25 58.5,12.38 58.5,3.88 U$2.K | 59.38,17.25 v59.5,17.38
  Bottom 0.102: v72.5,25.38 66.62,19.5 61.62,19.5 v59.5,17.38
A8_A13  (via drill 0.2)
  Top 0.102: IC8.5 69.25,25.62 68.25,26.62 50.88,26.62 v50.38,27.12 | 11,17.88 10,16.88 DBG_EXT.8 | 11,17.88 v16.12,23 | 11,17.88 11,13.88 10.25,13.12 10.25,3.88 U$2.E:D
  Bottom 0.102: v50.38,27.12 45.62,27.12 41.5,23 v16.12,23
A8_A14  (via drill 0.2)
  Top 0.102: v68.25,22.88 IC8.3 | v59.38,20.88 50.75,20.88 50.25,21.38 46.88,21.38 42.88,25.38 37.25,25.38 35.25,23.38 16.5,23.38 16.38,23.5 14.12,23.5 8.38,17.75 | 8.38,17.75 7.5,16.88 DBG_EXT.6 | 8.38,17.75 8.38,13.75 7.62,13 7.62,3.88 U$2.E:E
  Bottom 0.102: v68.25,22.88 66.25,20.88 v59.38,20.88
A8_A15  (via drill 0.2)
  Top 0.102: IC8.2 67.75,23.5 67.5,23.25 v61.62,23.25 | v31.38,46.38 18.62,46.38 1.25,29 1.25,20.5 4,17.75 | 4,17.75 4.88,16.88 DBG_EXT.4 | 4,17.75 4,13.75 5,12.75 5,3.88 U$2.E:F
  Bottom 0.102: v61.62,23.25 51.88,33 51.75,33 43.62,41.12 43.62,45.5 42.88,46.25 31.5,46.25 v31.38,46.38
A8_D0  (via drill 0.2)
  Top 0.102: v57.25,25.38 IC7.17
  Bottom 0.102: v57.25,25.38 57.25,22.38 57.5,22.12 57.5,17 56.88,16.38 56.88,14.62 56,13.75 DBG_CART.11 55.88,13.62 55.88,3.88 U$2.10
A8_D1  (via drill 0.2)
  Top 0.102: v58.25,22.38 IC7.19
  Bottom 0.102: v58.25,22.38 58.25,19.75 57.75,19.25 57.75,16.88 57.5,16.62 57.5,14.62 58.38,13.75 DBG_CART.13 58.5,13.62 58.5,3.88 U$2.9
A8_D2  (via drill 0.2)
  Top 0.102: v58.75,21.75 IC7.20
  Bottom 0.102: v58.75,21.75 58.75,19.88 58.12,19.25 58.12,18 60,16.12 60,14.75 61,13.75 DBG_CART.15 61,3.88 U$2.8
A8_D3  (via drill 0.2)
  Top 0.102: v56.75,22.5 IC7.16 | U$2.L 56,3.88 56,12.5 56.88,13.38 56.88,15.38 56,16.25 DBG_CART.12
  Bottom 0.102: v56.75,22.5 57.25,22 57.25,17.62 56,16.38 DBG_CART.12
A8_D4
  Top 0.102: IC7.23 60.25,21.12 65.12,16.25 65.12,14.62 66,13.75 DBG_CART.19
  Bottom 0.102: U$2.6 66.12,3.88 66.12,13.62 DBG_CART.19
A8_D5
  Top 0.102: IC7.22 59.75,21.25 62.62,18.38 62.62,14.62 63.5,13.75 DBG_CART.17
  Bottom 0.102: U$2.7 63.5,13.62 DBG_CART.17
A8_D6  (via drill 0.2)
  Top 0.102: IC7.14 55.75,23.25 v55.25,22.75
  Bottom 0.102: v55.25,22.75 53.12,22.75 52.38,22 52.38,14.75 53.38,13.75 DBG_CART.9 53.38,13.62 53.38,3.88 U$2.11
A8_D7  (via drill 0.2)
  Top 0.102: IC7.13 55.25,23.5 v54,22.25 | U$2.M 53.38,3.88 53.38,12.38 54.38,13.38 54.38,15.38 53.5,16.25 DBG_CART.10
  Bottom 0.102: v54,22.25 53,22.25 52.75,22 52.75,17 53.38,16.38 DBG_CART.10
A8_R/!W!  (via drill 0.2)
  Top 0.102: v42.62,28.62 43.12,28.62 IC4.4 | v42.62,24.88 42.62,23.75 45.75,20.62 45.75,16.38 DBG_CART.4 45.88,16.25 46.75,15.38 46.75,13.38 45.75,12.38 45.75,3.88 U$2.R
  Bottom 0.102: v42.62,24.88 v42.62,28.62
A8_RD4  (via drill 0.2)
  Top 0.102: IC7.11 54.25,24.88 55.25,25.88 66.5,25.88 v66.75,25.62 | U$2.A 78.75,3.88 78.75,12.38 79.75,13.38 79.75,15.38 78.88,16.25 DBG_CART.30
  Bottom 0.102: v66.75,25.62 67.75,26.62 74.12,26.62 78.75,22 78.75,16.38 DBG_CART.30
A8_RD5  (via drill 0.2)
  Top 0.102: v51.75,22.62 IC7.6
  Bottom 0.102: v51.75,22.62 51.75,21.12 46.75,16.12 46.75,14.62 45.88,13.75 DBG_CART.3 45.75,13.62 45.75,3.88 U$2.14
A9
  Top 0.102: IC8.38 72.25,36.88 63.88,45.25 U$1.6
A10
  Top 0.102: IC8.43 69.75,33 64.25,38.5 62.25,38.5 61.38,39.38 61.38,40.62 U$1.144
A11
  Top 0.102: IC8.41 70.75,36.88 63.88,43.75 U$1.3
A12
  Top 0.102: IC8.40 71.25,36.88 63.88,44.25 U$1.4
A13  (via drill 0.2)
  Top 0.102: IC8.44 69.25,32.5 v63.75,38 | v60.88,39.5 60.25,40.12 U$1.142
  Bottom 0.102: v63.75,38 62.38,38 v60.88,39.5
A14  (via drill 0.2)
  Top 0.102: IC8.46 68.25,32.75 v63.75,37.25 | v60.12,39.5 60.12,39.75 59.75,40.12 U$1.141
  Bottom 0.102: v63.75,37.25 62.38,37.25 v60.12,39.5
A15
  Top 0.102: IC8.47 67.75,32.5 61.25,39 59.88,39 59.25,39.62 U$1.140
AUDIO
  Bottom 0.102: DBG_EXT.5 7.5,14.12 7.5,3.88 U$2.E5
CBSEL0  (via drill 0.2)
  Top 0.102: v75.12,45.25 R23.2 | v58,42 58,41.62 57.75,41.38 U$1.137
  Bottom 0.102: v75.12,45.25 69.5,45.25 68,43.75 62.25,43.75 61.25,44.75 60.75,44.75 v58,42
CBSEL1  (via drill 0.2)
  Top 0.102: v80.62,45.25 R24.2 | v63.5,33 63.5,33.38 58.25,38.62 U$1.138
  Bottom 0.102: v80.62,45.25 80.12,45.25 76.75,41.88 76.75,33.25 76.5,33 v63.5,33
CBUS0
  Top 0.102: R6.2 40.38,58.5 41.12,57.75 U$1.78
CBUS1
  Top 0.102: R7.2 40.88,57.5 41.12,57.25 U$1.79
CBUS2
  Top 0.102: R8.2 40,56.5 40.25,56.75 U$1.80
CDONE  (via drill 0.2)
  Top 0.102: 65.62,59.5 v64.5,59.5 64.12,59.5 63.88,59.25 U$1.34 | v64.5,64.12 65.5,65.12 R30.1 | v68.75,58.5 67.25,60 66.12,60 65.62,59.5 | 65.62,59.5 R3.2
  Bottom 0.102: v64.5,59.5 v64.5,64.12 | v68.75,58.5 74.12,53.12 81,53.12 81.88,54 82.5,54 TTAG.3
CLK  (via drill 0.2)
  Top 0.102: IC7.44 51.25,32.88 46.5,37.62 v45,37.62 | U$1.110 v44.25,38.38
  Bottom 0.102: v44.25,38.38 v45,37.62
CLK25  (via drill 0.2)
  Top 0.102: v36.5,59.75 35.62,59.75 Y1.3 | v40.5,59.88 41.12,59.25 U$1.75
  Bottom 0.102: v36.5,59.75 40.38,59.75 v40.5,59.88
D0  (via drill 0.2)
  Top 0.102: v57.25,33 IC7.32 | U$1.123 v50.75,39
  Bottom 0.102: v57.25,33 56.75,33 v50.75,39
D1  (via drill 0.2)
  Top 0.102: v58.25,30.62 IC7.30 | v51.62,42 51.62,41.75 51.25,41.38 U$1.124
  Bottom 0.102: v58.25,30.62 58.25,33 59.25,34 59.25,36.25 53.5,42 v51.62,42
D2  (via drill 0.2)
  Top 0.102: v58.75,36 IC7.29 | v55.25,39.5 54.75,40 U$1.131
  Bottom 0.102: v55.25,39.5 v58.75,36
D3  (via drill 0.2)
  Top 0.102: v56.75,36.5 IC7.33 | v48.88,42 48.88,40.88 U$1.119
  Bottom 0.102: v56.75,36.5 51.75,41.5 49.38,41.5 v48.88,42
D4
  Top 0.102: IC7.26 60.25,35.25 56.25,39.25 U$1.134
D5  (via drill 0.2)
  Top 0.102: v59.75,35 IC7.27 | U$1.132 v55.25,42
  Bottom 0.102: v59.75,35 59.75,37.5 v55.25,42
D6  (via drill 0.2)
  Top 0.102: v55.75,35.5 IC7.35 | v48.88,39.5 48.25,40.12 U$1.118
  Bottom 0.102: v55.75,35.5 52,39.25 52,39.75 51.75,40 49.38,40 v48.88,39.5
D7  (via drill 0.2)
  Top 0.102: v55.25,33 IC7.36 | v48.88,38.75 47.75,39.88 U$1.117
  Bottom 0.102: v55.25,33 49.5,38.75 v48.88,38.75
DIR_A  (via drill 0.2)
  Top 0.102: R10.2 67.25,24.25 IC8.1 | IC8.24 78.75,24.88 73.62,30 67.25,30 66.5,30.75 | 66.5,30.75 58.75,38.5 U$1.139 | v64.75,24.25 R10.2 | 66.5,30.75 v64.75,29 | R10.2
  Bottom 0.102: v64.75,29 v64.75,24.25
DIR_D  (via drill 0.2)
  Top 0.102: 61.38,24.25 60.75,24.25 IC7.24 | 61.38,24.25 R11.2 | U$1.135 56.75,39.12 v61,34.88 | 61.38,24.25 v61.38,24.5
  Bottom 0.102: v61,34.88 61,24.88 v61.38,24.5
DIR_EXTSEL  (via drill 0.2)
  Top 0.102: R17.1 17.5,26.38 17.62,26.5 | 17.62,26.5 18,26.88 IC10.5 | v17.75,26.38 17.62,26.5 | v41.38,40 41.38,40.38 42.75,41.75 42.75,43.38 42.38,43.75 U$1.106
  Bottom 0.102: v17.75,26.38 17.75,27 30.75,40 v41.38,40
DIR_HALT  (via drill 0.2)
  Top 0.102: 8.5,25.62 R13.2 | 8.5,25.62 9,26.12 IC1.5 | 8.5,25.62 8,26.12 v8,27.38 | v43.5,48.38 41.88,48.38 U$1.97
  Bottom 0.102: v8,27.38 10.75,30.12 10.75,30.25 28.88,48.38 v43.5,48.38
DIR_IN  (via drill 0.2)
  Top 0.102: 48.62,23.75 48.88,23.75 49.25,24.12 IC7.1 | 48.62,23.75 R12.2 | U$1.102 42.62,45.75 v43.12,45.25 | 48.62,23.75 v48.62,23.5
  Bottom 0.102: v43.12,45.25 43.12,41 51,33.12 51,25.88 v48.62,23.5
DIR_IRQ  (via drill 0.2)
  Top 0.102: IC11.5 15,26 | 15,26 15,25.88 14.5,25.38 R18.1 | v15.25,26 15,26 | U$1.99 v40.5,47.25
  Bottom 0.102: v15.25,26 15.25,27 13.5,28.75 13.5,29.25 31.5,47.25 v40.5,47.25
DIR_MPD  (via drill 0.2)
  Top 0.102: IC9.5 6,26 | 6,26 6,25.88 5.5,25.38 R19.1 | v6.25,26 6,26 | v43,51 42.62,51 42.38,50.75 U$1.92
  Bottom 0.102: v6.25,26 6.25,28.75 28.5,51 v43,51
DIR_REF  (via drill 0.2)
  Top 0.102: R15.2 2.5,26.38 2.62,26.5 | 2.62,26.5 3,26.88 IC6.5 | v2.75,26.38 2.62,26.5 | v43,52.5 42.62,52.5 42.38,52.25 U$1.89
  Bottom 0.102: v2.75,26.38 2.75,27.75 27.5,52.5 v43,52.5
DIR_RST  (via drill 0.2)
  Top 0.102: IC5.5 12,26 | 12,26 12,25.88 11.5,25.38 R14.2 | v12.25,26 12,26 | v43,46.88 42.38,46.25 U$1.101
  Bottom 0.102: v12.25,26 12.25,28.38 31.62,47.75 42.12,47.75 v43,46.88
DIR_RW
  Top 0.102: 43,27.88 R16.2 | 43,27.88 43.5,28.38 IC4.5 | 43,27.88 42.62,27.88 41.75,28.75 41.75,39.62 43.38,41.25 43.38,41.5 43.62,41.75 45.38,41.75 45.75,41.38 U$1.113
GND  (via drill 0.2)
  Top 0.102: IC7.10 53.75,23.5 54,23.25 54.5,23.25 54.75,23.5 IC7.12 54.75,24.88 55,25.12 56,25.12 56.25,24.88 IC7.15 56.25,21.25 | 56.25,21.25 C48.2 59,21.25 59.25,21.5 IC7.21 59.25,24.88 59.5,25.12 62.25,25.12 62.5,24.88 R11.1 R10.1 65.5,24.88 66.75,24.88 67,25.12 68.5,25.12 68.75,24.88 IC8.4 68.75,22.38 69.88,21.25 C49.2 71.75,21.25 | 56.25,21.25 C47.2 51.88,21.25 51,22.12 | IC7.4 50.75,22.38 51,22.12 | 74.25,21.25 C50.2 77,21.25 77.25,21.5 IC8.21 | 74.25,21.25 71.75,21.25 | 71.75,21.25 IC8.10 | 74.25,21.25 IC8.15 | C39.2 38.75,61.12 39,61.38 40.12,61.38 v40.38,61.12 | v36,62.12 33.75,62.12 32.62,61 32.62,60.5 32.88,60.25 C54.2 33.88,60.25 34.38,59.75 Y1.2 34.38,58.88 C42.2 C32.2 C31.2 C26.2 C38.2 38.75,44 40.75,42 C20.2 40.75,40.75 35.75,35.75 35.75,29 | R14.1 C7.2 12.88,24.38 14.75,24.38 15.12,24.75 C17.2 16.88,24.75 17.25,24.38 18.12,24.38 C15.2 24.5,24.75 C56.2 28.25,25.25 | R15.1 C9.2 4.88,24.75 5.25,24.38 6.12,24.38 C13.2 R13.1 | R13.1 C11.2 R14.1 | R13.1 | R14.1 | C6.2 35,25.12 34.75,25.38 IC2.3 34.62,25.5 34.62,25.88 IC2.7 32.75,26.5 | 28.25,25.25 30,25.25 C55.2 30.62,25.75 31.38,26.5 32.75,26.5 | 28.25,25.25 IC13.9 | 46.25,24.38 45.88,24.38 C4.2 R16.1 43,26.12 40.12,29 35.75,29 | 46.25,24.38 47.5,24.38 R12.1 | 35.75,29 C1.2 34.5,29 33.88,29.62 32.88,29.62 32.75,29.5 32.75,26.5 | 51,22.12 50.5,21.62 49,21.62 46.25,24.38 | U$1.126 U$1.127 52.75,41.38 52.88,41.5 | U$1.129 53.75,41.38 53.38,41.75 53.12,41.75 52.88,41.5 | U$1.121 49.5,40.75 | 49.5,40.75 49.38,40.75 | 44,44.75 46.88,44.75 49.12,42.5 | 44,44.75 U$1.104 | 49.12,42.5 49.38,42.25 49.38,40.75 | 49.38,40.75 U$1.120
  Top 0.102: U$1.94 43.12,49.75 44,48.88 44,44.75 | 52.88,41.5 51.88,42.5 49.12,42.5 | 48,65.5 48.25,65.5 C33.2 C35.2 C24.2 C28.2 54.88,65.12 | 55.5,65.5 55.25,65.5 54.88,65.12 | U$1.64 47.75,63.5 47.38,63.88 47.38,64.88 48,65.5 | 48,65.5 C22.2 | U$1.50 54.75,63.88 54.88,64 54.88,65.12 | U$1.44 57.75,63.25 57.5,63.5 | 55.5,65.5 57.5,63.5 | 55.5,65.5 C34.2 | U$1.5 62.62,44.75 62.25,45.12 62.25,46.38 62.62,46.75 U$1.9 65.12,46.75 66.88,48.5 | U$1.37 62,62.25 | 62,62.25 R32.1 64,62.88 68.38,67.25 | IC10.2 18,28.12 18.25,28.38 C16.2 18.12,29 18,29.12 17.12,29.12 v17,29 | IC11.2 15,28.12 15.25,28.38 C18.2 15.12,29 15,29.12 14.12,29.12 v14,29 | IC9.2 6,28.12 6.25,28.38 C14.2 6.12,29 6,29.12 5.12,29.12 v5,29 | C19.2 66.25,48.5 | 66.25,48.5 C29.2 | 3,29 v2,29 1.5,28.5 1.5,25.62 2.38,24.75 R15.1 | 3,29 C10.2 | v8,29 9,29 | 9,29 C12.2 | v11,29 12,29 | 12,29 C8.2 | v42.5,30.5 43.5,30.5 | 43.5,30.5 C5.2 | v52,35.5 C43.2 | v58,35.5 C44.2 | v70,35.5 C45.2 | v75.5,35.5 C46.2 | v50,37.5 50,38.12 | 50,38.12 C30.2 | v51.5,37.5 C37.2 | v53,37.5 C40.2 | v54.5,37.5 54.5,38 | 54.5,38 C36.2 | v62.5,39 C25.2 | v65,41.5 64.5,41.5 | 64.5,41.5 C41.2 | v69.5,49 C51.2 | v67,52 C27.2 | v67,53 C21.2 | v67,54 C23.2 | 69.25,67.25 69.25,67.75 69.62,68.12 RESET.1 | 69.25,67.25 69.25,66.12 | 69.25,66.12 C53.2 69.25,65.38 70,64.62 70,62 SPV.1 | 3,29 IC6.2 | 9,29 IC1.2 | 12,29 IC5.2 | 43.5,30.5 IC4.2 | 69.25,67.25 68.38,67.25 | 68.38,67.25 IC12.2 | 66.88,48.5 66.25,48.5 | 69.25,66.12 72.38,66.12 73,65.5 C52.2 | v48.5,31.5 48.75,31.75 49.25,31.75 IC7.48 | IC7.45 50.75,30.75 v50.5,30.5 | 53.75,30.88 53.75,30.75 v53.5,30.5 | 53.75,30.88 IC7.39 | IC7.37 54.75,31.12 54.5,30.88 53.75,30.88 | IC7.34 56.25,30.75 v56.5,30.5
  Top 0.102: IC7.28 59.25,30.75 v59.5,30.5 | v61.5,31.5 61.25,31.75 60.75,31.75 IC7.25 | v66.5,31.5 66.75,31.75 67.25,31.75 IC8.48 | IC8.45 68.75,30.75 v69,30.5 | IC8.39 71.75,30.75 v72,30.5 | IC8.34 74.25,30.75 v74,30.5 | IC8.28 77.25,30.75 v77,30.5 | v79.5,31.5 79.25,31.75 78.75,31.75 IC8.25 | U$1.108 41.75,41.75 v41.88,41.62 | U$1.133 55.75,39.25 54.5,38 | 64.5,41.5 U$1.1 | 66.88,48.5 v67,48.5 | v74.5,43.5 74.5,45.38 FLASH.4 | U$2.E:H 2.62,3.88 2.62,12.62 3.38,13.38 3.38,15.88 2.5,16.75 DBG_EXT.2 | U$2.B 76.12,3.88 76.12,12.5 75.25,13.38 75.25,15.38 76.12,16.25 DBG_CART.28 | 57.5,63.5 58,64 60.25,64 62,62.25 | 49.5,40.75 49.5,38.62 50,38.12 | R15.1
  Bottom 0.102: v40.38,61.12 39,61.12 38,62.12 v36,62.12 | v41.88,41.62 41.88,31.12 v42.5,30.5
  pour Route15: -1,78.5 86,78.5 86,-1 -1,-1
LED0  (via drill 0.2)
  Top 0.102: v59,64.5 LD0.- | v60,63.5 60,63.12 60.25,62.88 U$1.39
  Bottom 0.102: v60,63.5 v59,64.5
LED1  (via drill 0.2)
  Top 0.102: v56,66.5 LD1.- | v59,63.5 59,63.12 59.25,62.88 U$1.41
  Bottom 0.102: v59,63.5 v56,66.5
LED2  (via drill 0.2)
  Top 0.102: v53,68.75 LD2.- | U$1.43 v58.25,63.5
  Bottom 0.102: v58.25,63.5 v53,68.75
N$1
  Top 0.102: R23.1 80,43.12 80.75,42.38 80.75,41.25 CBSEL0.2
N$2
  Top 0.102: C1.1 33.5,29 34.12,28.38 34.12,28.3 | 37.49,27.74 37.5,27.75 V12.2
  Top 0.254: IC2.6 34.1,28.3 34.12,28.3 36.93,28.3 37.11,28.11 | 37.11,28.11 37.49,27.74 V12.2 | IC2.5 34,27.85 34.25,28.1 37.1,28.1 37.11,28.11
N$3
  Top 0.102: R24.1 83.5,43.12 84.25,42.38 84.25,41.25 CBSEL1.2
N$5
  Top 0.102: IC12.1 R30.2
N$6
  Top 0.102: DONE.- IC12.3
N$7
  Top 0.102: R29.2 64.5,71.25 DONE.+
N$8
  Top 0.102: R32.2 64,61 U$1.36
N$9
  Top 0.102: R31.2 61,71.25 STATUS.+
N$10  (via drill 0.2)
  Top 0.102: v40.12,58 39.12,58 38.75,58.38 R6.1
  Bottom 0.102: v40.12,58 41,58 43.5,55.5 43.5,55 41.62,53.12 18,53.12 8.88,62.25 7.75,62.25 CBUS0.2
N$11
  Top 0.102: CBUS1.2 7.75,62.25 8.88,62.25 9.5,62.88 36.38,62.88 37.5,61.75 37.5,59.12 38.62,58 38.62,57.5 R7.1
N$12
  Top 0.102: CBUS2.2 7.75,58.75 8.88,58.75 12.75,62.62 36.25,62.62 37.25,61.62 37.25,58.38 38.62,57 38.62,56.5 R8.1
N$13
  Top 0.102: R33.2 57.5,71.25 LD0.+
N$15
  Top 0.102: R34.2 54.5,71.25 LD1.+
N$16
  Top 0.102: R35.2 51.5,71.25 LD2.+
N$18
  Top 0.102: IC13.1 27.75,27 27.75,26.75 IC13.2 27.62,26.62 25,26.62 | 25,26.62 25,25.88 | 25,25.88 C56.1 | 25,26.62 24,27.62 V3.3.2 | 25,25.88 27.62,25.88 IC13.4
PWRGD_1V2  (via drill 0.2)
  Top 0.102: v29.62,26.25 28.88,26.25 IC13.6 | v31.12,27.75 30.5,28.38 R1.1 | v35.25,27.5 34.75,27.5 IC2.4
  Bottom 0.102: v31.12,27.75 30.88,27.5 | 30.88,27.5 v29.62,26.25 | 30.88,27.5 v35.25,27.5
R/!W!
  Top 0.102: U$1.111 44.75,38.12 42,35.38 42,30.25 42.88,29.38 43.12,29.38 IC4.3
RD4  (via drill 0.2)
  Top 0.102: v54.25,33 IC7.38 | v47.38,39.5 47.38,40.62 U$1.116
  Bottom 0.102: v54.25,33 53.62,33 53.5,32.88 53,32.88 52.5,33.38 52.5,33.75 48,38.25 47.62,38.25 47.38,38.5 v47.38,39.5
RD5
  Top 0.102: IC7.43 51.75,33 45.25,39.5 U$1.112
RSRVD
  Top 0.102: DBG_EXT.14 17.62,16.75 17.62,15.62 18.62,14.62 18.62,4.62 17.88,3.88 U$2.E:A
SPI_CLK  (via drill 0.2)
  Top 0.102: U$1.30 64.88,57.25 v66,56.12 | 73.12,49.25 73.12,50.5 FLASH.6 | 73.12,49.25 81.88,49.25 84.25,51.62 84.25,61.62 82.62,63.25 82.62,64 TTAG.13 | 73.12,49.25 v73.12,49
  Bottom 0.102: v73.12,49 v66,56.12
SPI_CSI
  Top 0.102: R2.2 64.12,58.5 63.88,58.25 U$1.32
SPI_D0  (via drill 0.2)
  Top 0.102: v64.62,56.75 U$1.29 | 75,51.12 74.5,50.62 FLASH.5 | 75,51.12 83.38,51.12 84,51.75 84,60.25 82.62,61.62 82.62,62 TTAG.11 | 75,51.12 v75.12,51.25
  Bottom 0.102: v64.62,56.75 69.62,56.75 v75.12,51.25
SPI_D1  (via drill 0.2)
  Top 0.102: U$1.28 65.12,56.25 65.75,55.62 v70,55.62 | v81,48.75 74.88,48.75 71.88,45.75 71.88,45.5 FLASH.2
  Bottom 0.102: v70,55.62 74.88,50.75 80.62,50.75 81.62,51.75 81.62,52.75 82,53.12 83,53.12 83.5,53.62 | 83.5,53.62 83.5,59.12 82.62,60 TTAG.9 | v81,48.75 83.5,51.25 83.5,53.62
SPI_D2
  Top 0.102: U$1.20 64,52.25 66.12,50.12 69.12,50.12 70.12,49.12 70.12,44.12 72.25,44.12 73.12,45 73.12,45.38 FLASH.3
SPI_D3  (via drill 0.2)
  Top 0.102: U$1.19 64.12,51.75 v66.25,49.62 | FLASH.7 71.88,50.62 71.88,51 73.88,53 81.62,53 82.5,52.12 TTAG.1
  Bottom 0.102: v66.25,49.62 71.75,49.62 72.88,48.5 79,48.5 82.5,52 TTAG.1
SPI_SS  (via drill 0.2)
  Top 0.102: U$1.31 63.88,57.75 64.12,57.5 R4.2 65.75,57.38 66,57.12 v75.5,57.12 | FLASH.1 70.62,45.5 70.62,49 71.38,49.75 71.38,51.88 76.25,56.75 80,56.75 80.38,57.12 81.62,57.12 82.5,58 TTAG.7
  Bottom 0.102: v75.5,57.12 76.12,57.12 78.12,55.12 81,55.12 81.62,55.75 81.62,56.88 82.5,57.75 82.5,58 TTAG.7
TCK
  Top 0.102: 77.25,57.38 R28.2 77.25,57.38 | 77.25,57.38 77.5,57.12 79.62,57.12 80.5,58 TTAG.8 | U$1.26 69.62,55.25 69.75,55.12 74.25,55.12 76.12,57 76.88,57 77.25,57.38
TDI  (via drill 0.2)
  Top 0.102: R26.2 77.25,63.62 77.62,64 80.5,64 TTAG.14 | v61.5,55.75 U$1.27 | v66.38,60.62 74.38,60.62 R26.2 | R26.2
  Bottom 0.102: v66.38,60.62 v61.5,55.75
TDO  (via drill 0.2)
  Top 0.102: v77.25,62.12 R27.2 | U$1.24 61.75,54.25 v61.25,54.75
  Bottom 0.102: 77.88,62.12 80.5,62.12 TTAG.12 | 77.88,62.12 v77.25,62.12 | v61.25,54.75 67.12,60.62 76.38,60.62 77.88,62.12
TMS  (via drill 0.2)
  Top 0.102: v77.25,60.12 R25.2 | v62,54.75 U$1.25
  Bottom 0.102: 77.88,60.12 80.5,60.12 TTAG.10 | 77.88,60.12 v77.25,60.12 | v62,54.75 64.12,56.88 64.12,57 66.12,59 76.75,59 77.88,60.12
XIO_BOX_CLK  (via drill 0.2)
  Top 0.102: v32.88,68.12 32.88,69 UHDMI.19 | U$1.69 45.25,62.88 41.75,66.38 30.75,66.38 v30.62,66.5
  Bottom 0.102: v32.88,68.12 31.38,68.12 30.62,67.38 | 30.62,67.38 30.12,67.38 29.5,68 29.5,68.25 26.12,71.62 23.12,71.62 DBG_XIO0.9 | 30.62,67.38 v30.62,66.5
XIO_BOX_CTS  (via drill 0.2)
  Top 0.102: v33.62,71.88 32.62,70.88 32.62,70.38 UHDMI.18 | v52.25,63.75 U$1.55
  Bottom 0.102: v33.62,71.88 37.38,71.88 38.5,73 47.75,73 49,71.75 DBG_XIO1.9 49.12,71.62 49.12,71.12 52.25,68 v52.25,63.75
XIO_BOX_RTS  (via drill 0.2)
  Top 0.102: UHDMI.17 32.38,69 32.38,67.88 32.88,67.38 34.62,67.38 38.88,71.62 DBG_XIO1.1 | U$1.68 45.75,64.62 v42.5,67.88
  Bottom 0.102: v42.5,67.88 39,71.38 39,71.62 DBG_XIO1.1
XIO_D0  (via drill 0.2)
  Top 0.102: v29,68 29.5,68.5 29.5,69 UHDMI.3 | U$1.84 40.5,54.75 v40,55.25
  Bottom 0.102: DBG_XIO0.1 13,71.62 13.88,70.75 26.38,70.75 28.12,69 28.12,68.88 v29,68 29,66.5 40,55.5 v40,55.25
XIO_D1
  Top 0.102: UHDMI.5 30,68.25 29.12,67.38 28.62,67.38 | 28.62,67.38 24.88,67.38 20.62,71.62 DBG_XIO0.7 | U$1.72 42.62,62.25 39,65.88 31.12,65.88 31,65.75 30.25,65.75 28.62,67.38
XIO_D2  (via drill 0.2)
  Top 0.102: UHDMI.6 30.12,70.38 30.12,71.25 29.5,71.88 v27.62,71.88 26.75,71.88 25.88,71 v25.88,69.75 | v40.5,56.25 U$1.81
  Bottom 0.102: v27.62,71.88 27.25,71.88 23.62,75.5 19.12,75.5 18,74.38 DBG_XIO0.6 | v40.5,56.25 40.5,55 40.25,54.75 39.75,54.75 32.62,61.88 32.62,62.38 27.5,67.5 27.5,68.12 v25.88,69.75
XIO_D3  (via drill 0.2)
  Top 0.102: 19.25,73 23.12,73 23.75,72.38 29.38,72.38 30.5,71.25 30.5,70.38 UHDMI.8 | 19.25,73 18,71.75 DBG_XIO0.5 | U$1.77 43.25,58.25 v43.75,58.75 | v38.75,65.38 20.5,65.38 14.5,71.38 14.5,74.62 15.12,75.25 18.38,75.25 19.25,74.38 19.25,73
  Bottom 0.102: v43.75,58.75 43.75,60.38 v38.75,65.38
XIO_D4  (via drill 0.2)
  Top 0.102: v42.75,66.62 31.38,66.62 30.88,67.12 30.88,69 UHDMI.9 | v43.88,67.75 47.5,71.38 47.5,73.38 46.62,74.25 DBG_XIO1.8 | v51.75,60.88 U$1.56
  Bottom 0.102: v42.75,66.62 v43.88,67.75 43.88,70 44.12,70.25 44.62,70.25 44.88,70 44.88,65.12 49.5,60.5 50,60.5 50.38,60.88 v51.75,60.88
XIO_D5  (via drill 0.2)
  Top 0.102: v31.38,67.38 31.25,67.5 31.25,69 UHDMI.11 | v34.38,67.88 34.62,67.88 38,71.25 38,72.12 38.88,73 42.75,73 | 42.75,73 44,74.25 DBG_XIO1.6 | U$1.59 50.25,60.62 v49.62,60 | v44.38,69.75 42.75,71.38 42.75,73
  Bottom 0.102: v31.38,67.38 33.88,67.38 v34.38,67.88 | v49.62,60 44.38,65.25 v44.38,69.75
XIO_D6  (via drill 0.2)
  Top 0.102: UHDMI.12 31.38,70.38 31.38,73.25 33.5,75.38 37.88,75.38 38.88,74.38 DBG_XIO1.2 | U$1.66 46.75,61.62 46.12,61 v44.62,61
  Bottom 0.102: v44.62,61 43.88,61 34.12,70.75 31.88,70.75 31.62,71 31.62,71.5 32.5,72.38 37,72.38 38.88,74.25 DBG_XIO1.2
XIO_D7  (via drill 0.2)
  Top 0.102: 36.75,72.38 37.88,72.38 38.75,73.25 40.38,73.25 41.38,74.25 DBG_XIO1.4 | 36.75,72.38 32.5,72.38 31.62,71.5 31.62,71 31.75,70.88 31.75,70.38 UHDMI.14 | U$1.61 49.25,61.62 v48.25,60.62 | 36.75,72.38 v36.75,70.75
  Bottom 0.102: v48.25,60.62 46.88,60.62 v36.75,70.75
XIO_HOST_CLK
  Top 0.102: UHDMI.15 32,67.88 32.75,67.12 36.88,67.12 40.88,71.12 | 40.88,71.12 41.38,71.62 DBG_XIO1.3 | U$1.65 47.25,63.62 43,67.88 43,69 40.88,71.12
XIO_HOST_CTS  (via drill 0.2)
  Top 0.102: 27,69.25 24.25,69.25 21.5,72 21.5,72.12 20.88,72.75 20.25,72.75 19,71.5 19,71.38 18.38,70.75 17.62,70.75 16.38,72 16.38,73.38 15.5,74.25 DBG_XIO0.4 | 27,69.25 28.5,69.25 29,69.75 29,69.88 29.38,70.25 UHDMI.2 | v43,55.25 U$1.83 | 27,69.25 v27,67.88
  Bottom 0.102: v43,55.25 41.12,55.25 40.38,54.5 39.62,54.5 32.38,61.75 32.38,62.25 27,67.62 v27,67.88
XIO_HOST_RTS  (via drill 0.2)
  Top 0.102: v27.62,68.75 27.88,69 29.12,69 UHDMI.1 | U$1.86 40.62,53.75 v40.5,53.62
  Bottom 0.102: v27.62,68.75 25.88,70.5 23.25,70.5 | 23.25,70.5 12.75,70.5 12,71.25 12,73.38 12.88,74.25 DBG_XIO0.2 | v40.5,53.62 40.12,53.62 23.25,70.5
XIO_SHLD1  (via drill 0.2)
  Top 0.102: v29.25,71.38 29.75,70.88 29.75,70.38 UHDMI.4 | U$1.82 38.88,55.75 37,57.62 37,60.38 v36.75,60.62
  Bottom 0.102: DBG_XIO0.3 15.5,71.75 16.5,72.75 17.88,72.75 19,73.88 19,74.12 20.12,75.25 23.5,75.25 27.38,71.38 v29.25,71.38 30.38,70.25 32.75,70.25 34.88,68.12 34.88,62.5 v36.75,60.62
XIO_SHLD2  (via drill 0.2)
  Top 0.102: U$1.71 44.25,62.88 41,66.12 31,66.12 30.88,66 30.38,66 30.12,66.25 30.12,66.75 30.38,67 v30.38,67.88 30.38,69 UHDMI.7
  Bottom 0.102: v30.38,67.88 24,74.25 23.12,74.25 DBG_XIO0.10
XIO_SHLD3  (via drill 0.2)
  Top 0.102: 31,72.12 31,72.88 28.5,75.38 21.62,75.38 20.62,74.38 DBG_XIO0.8 | 31,72.12 UHDMI.10 | v43,58.75 U$1.76 | 31,72.12 v30.88,72.12
  Bottom 0.102: v43,58.75 43.5,59.25 43.5,59.88 32.88,70.5 31.75,70.5 30.88,71.38 v30.88,72.12
XIO_SHLD4  (via drill 0.2)
  Top 0.102: v41.75,69.38 39.25,66.88 32.62,66.88 31.62,67.88 31.62,69 UHDMI.13 | v49.75,61 U$1.60
  Bottom 0.102: 44,71.62 v41.75,69.38 | v49.75,61 49.75,62.62 45.12,67.25 45.12,70.5 44,71.62 | 44,71.62 DBG_XIO1.5
XIO_SHLD5  (via drill 0.2)
  Top 0.102: v32.12,71.25 32.12,70.38 UHDMI.16 | U$1.58 50.75,62.88 49.88,63.75 v49.38,63.75
  Bottom 0.102: v32.12,71.25 37.12,71.25 38.62,72.75 45.5,72.75 46.5,71.75 DBG_XIO1.7 46.62,71.62 47.25,71 47.25,66.25 49.38,64.12 v49.38,63.75

## Text on the board
tNames: + | + | + | + | + | - | - | - | - | - | H | H | HOST_RTS / HOST_CTS / D2 / SHLD3 / SHLD2 | D6 / D7 / D5 / D4 / GND | H | D0 / SHLD1 / D3 / D1 / BOX_CLK | BOX_RTS / HOST_CLK / SHLD4 / SHLD5 / BOX_CTS | XE HOST | v1 ©SjG 2021 | GND / A15 / A14 / A13 / !HALT! / !IRQ! / RSRVD | CLK / R/!W! / A10 / A11 / D7 / D3 / A12 / A9 / A8 / A7 / A6 / A5 / A4 / GND / RD4 | +5v / !REF! / AUDIO / !MPD! / !D1xx! / !RESET! / !EXTSEL! | !CCTL! / RD5 / +5V / !S5! / D6 / D0 / D1 / D2 / D5 / D4 / A0 / A1 / A2 / A3 / !S4! | H | H